# EAGLE design QuadADSR-v1 (EAGLE 9.1.3)

## Sheet 1 of 3: Main
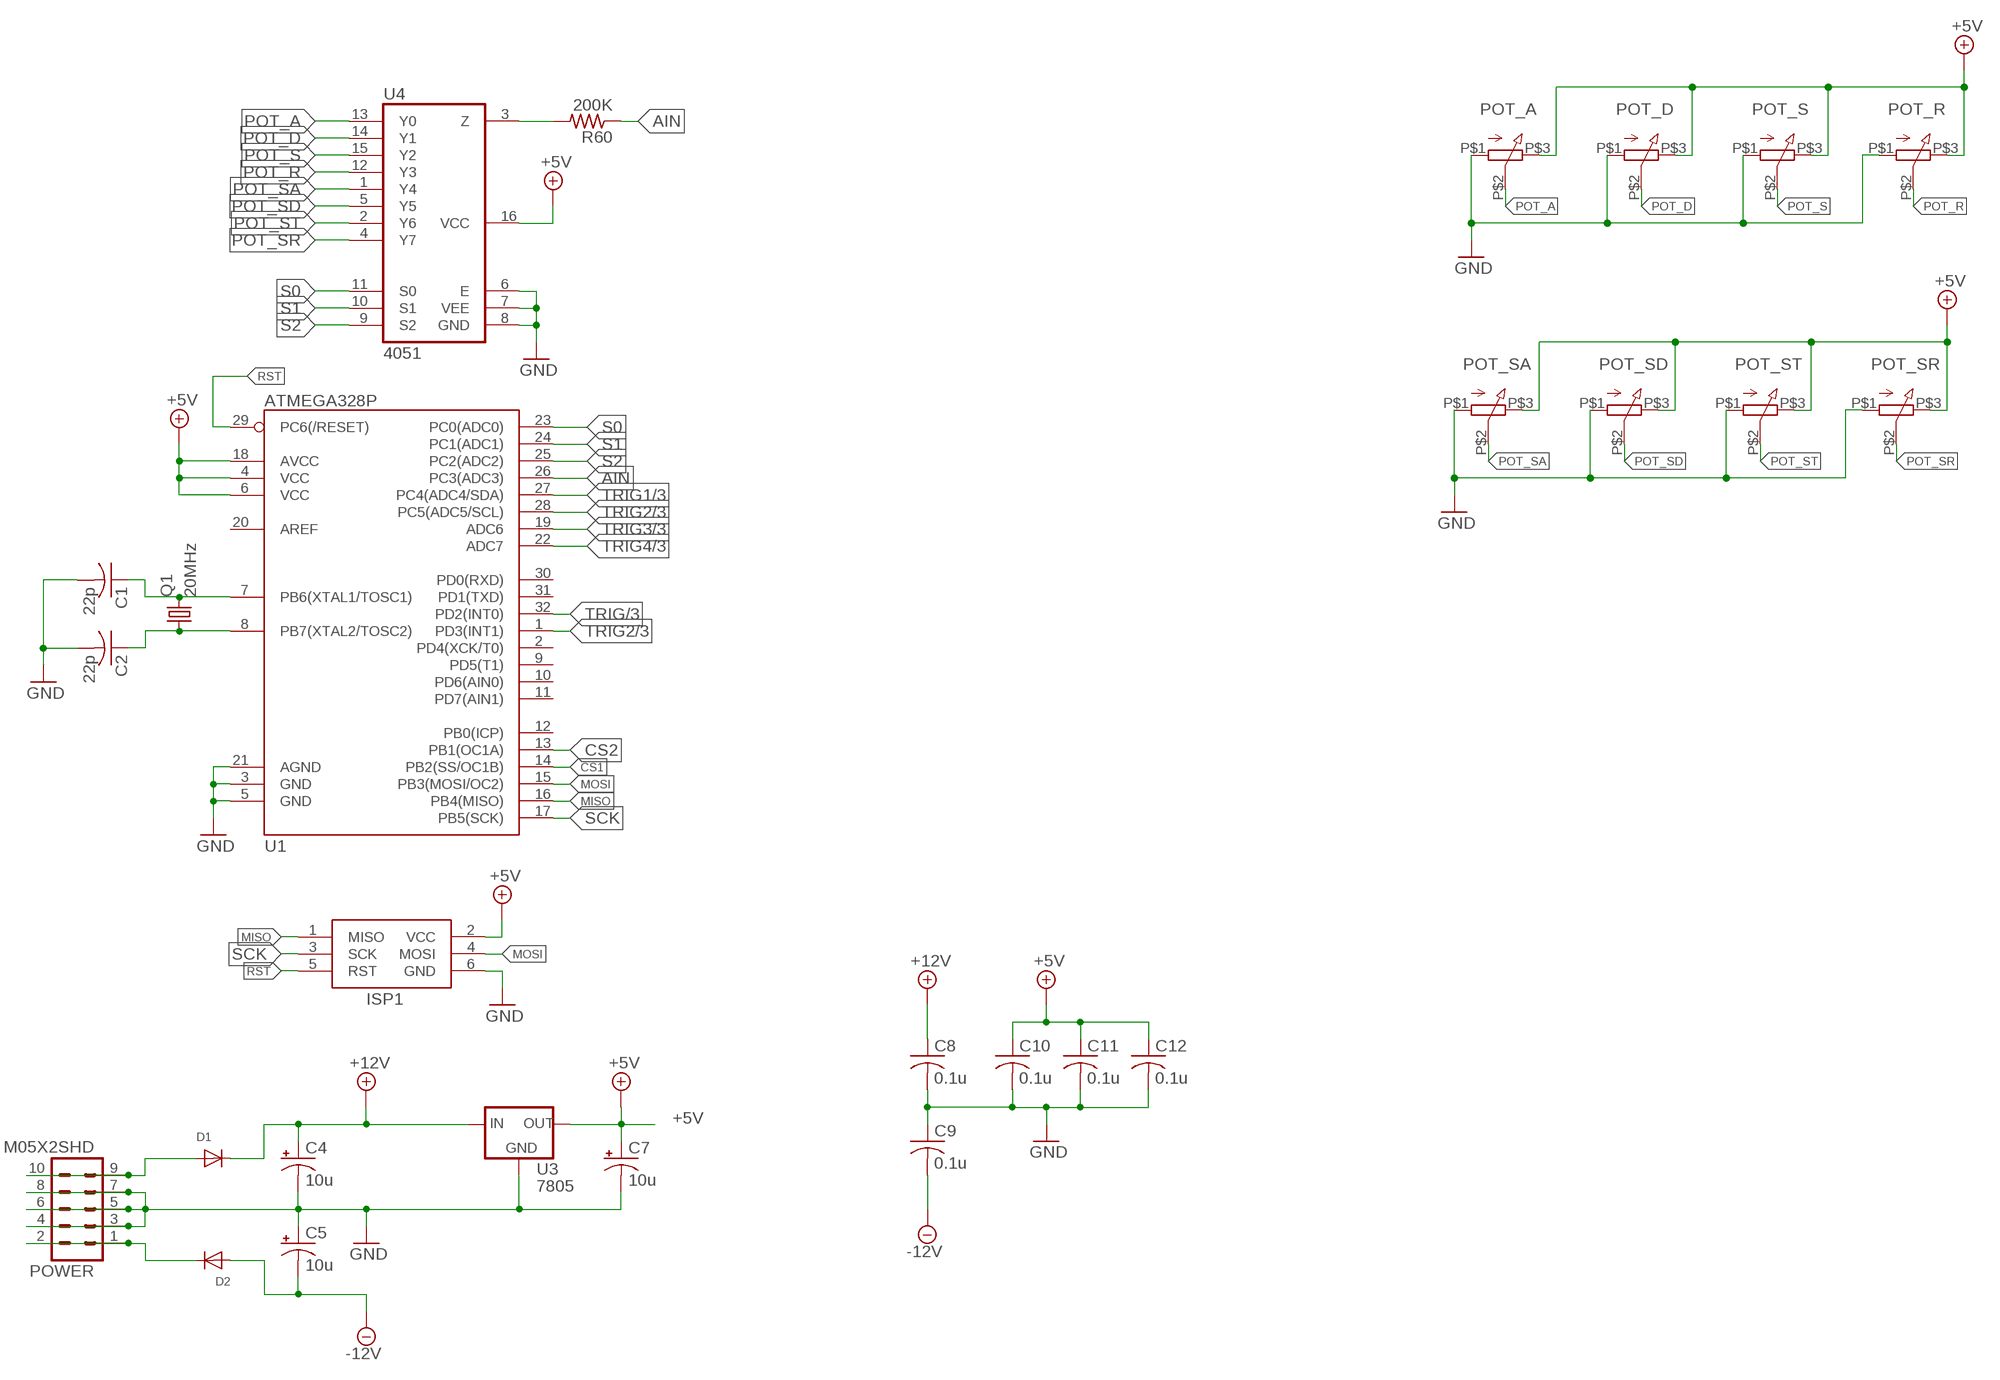
[diagram p0: schematic, sheet 1]

### Parts
C1  22p  C-USC0805K  [C0805K]
C2  22p  C-USC0805K  [C0805K]
C4  10u  CPOL-US153CLV-0505  [153CLV-0505]
C5  10u  CPOL-US153CLV-0505  [153CLV-0505]
C7  10u  CPOL-US153CLV-0505  [153CLV-0505]
C8  0.1u  C-USC0805K  [C0805K]
C9  0.1u  C-USC0805K  [C0805K]
C10  0.1u  C-USC0805K  [C0805K]
C11  0.1u  C-USC0805K  [C0805K]
C12  0.1u  C-USC0805K  [C0805K]
D1  DIODESMA  [SMADIODE]
D2  DIODESMA  [SMADIODE]
ISP1  AVRISP-6  [AVRISP]
POT_A  Q-POT  [Q-POT]
POT_D  Q-POT  [Q-POT]
POT_R  Q-POT  [Q-POT]
POT_S  Q-POT  [Q-POT]
POT_SA  Q-POT  [Q-POT]
POT_SD  Q-POT  [Q-POT]
POT_SR  Q-POT  [Q-POT]
POT_ST  Q-POT  [Q-POT]
POWER  M05X2SHD  [2X5-SHROUDED]
Q1  20MHz  CRYSTALHC49UP  [HC49UP]
R60  200K  R-US_R0805  [R0805]
U1  ATMEGA328P  ATMEGA328_SMT  [TQFP32-08]
U3  7805  V-REG  [V-REG]
U4  4051  MUX!  [N2222_ARRAY]

### Nets
+5V: C7.+ C10.1 C11.1 C12.1 ISP1.2(VCC) POT_A.P$3 POT_D.P$3 POT_R.P$3 POT_S.P$3 POT_SA.P$3 POT_SD.P$3 POT_SR.P$3 POT_ST.P$3 U1.4(VCC) U1.6(VCC) U1.18(AVCC) U3.3(OUT) U4.16(VCC) ; also sheet 2,3
+12V [Power]: C4.+ C8.1 D1.C U3.1(IN) ; also sheet 2
-12V [Power]: C5.- C9.2 D2.A ; also sheet 2
AIN: R60.1 U1.26(PC3(ADC3))
CS1: U1.14(PB2(SS/OC1B)) ; also sheet 2
CS2: U1.13(PB1(OC1A)) ; also sheet 2
GND [Power]: C1.2 C2.2 C4.- C5.+ C7.- C8.2 C9.1 C10.2 C11.2 C12.2 ISP1.6(GND) POT_A.P$1 POT_D.P$1 POT_R.P$1 POT_S.P$1 POT_SA.P$1 POT_SD.P$1 POT_SR.P$1 POT_ST.P$1 POWER.3 POWER.4 POWER.5 POWER.6 POWER.7 POWER.8 U1.3(GND) U1.5(GND) U1.21(AGND) U3.4(GND) U4.6(E) U4.7(VEE) U4.8(GND) ; also sheet 2,3
MISO: ISP1.1(MISO) U1.16(PB4(MISO))
MOSI: ISP1.4(MOSI) U1.15(PB3(MOSI/OC2)) ; also sheet 2
N$1: C1.1 Q1.2 U1.7(PB6(XTAL1/TOSC1))
N$2: C2.1 Q1.1 U1.8(PB7(XTAL2/TOSC2))
N$9: D1.A POWER.9 POWER.10
N$10: D2.C POWER.1 POWER.2
N$69: R60.2 U4.3(Z)
POT_A: POT_A.P$2 U4.13(Y0)
POT_D: POT_D.P$2 U4.14(Y1)
POT_R: POT_R.P$2 U4.12(Y3)
POT_S: POT_S.P$2 U4.15(Y2)
POT_SA: POT_SA.P$2 U4.1(Y4)
POT_SD: POT_SD.P$2 U4.5(Y5)
POT_SR: POT_SR.P$2 U4.4(Y7)
POT_ST: POT_ST.P$2 U4.2(Y6)
RST: ISP1.5(RST) U1.29(PC6(/RESET))
S0: U1.23(PC0(ADC0)) U4.11(S0)
S1: U1.24(PC1(ADC1)) U4.10(S1)
S2: U1.25(PC2(ADC2)) U4.9(S2)
SCK: ISP1.3(SCK) U1.17(PB5(SCK)) ; also sheet 2
TRIG: U1.32(PD2(INT0)) ; also sheet 3
TRIG1: U1.27(PC4(ADC4/SDA)) ; also sheet 3
TRIG2: U1.1(PD3(INT1)) U1.28(PC5(ADC5/SCL)) ; also sheet 3
TRIG3: U1.19(ADC6) ; also sheet 3
TRIG4: U1.22(ADC7) ; also sheet 3
Unconnected: U1.2(PD4(XCK/T0)) U1.9(PD5(T1)) U1.10(PD6(AIN0)) U1.11(PD7(AIN1)) U1.12(PB0(ICP)) U1.20(AREF) U1.30(PD0(RXD)) U1.31(PD1(TXD))

## Sheet 2 of 3: Analog out
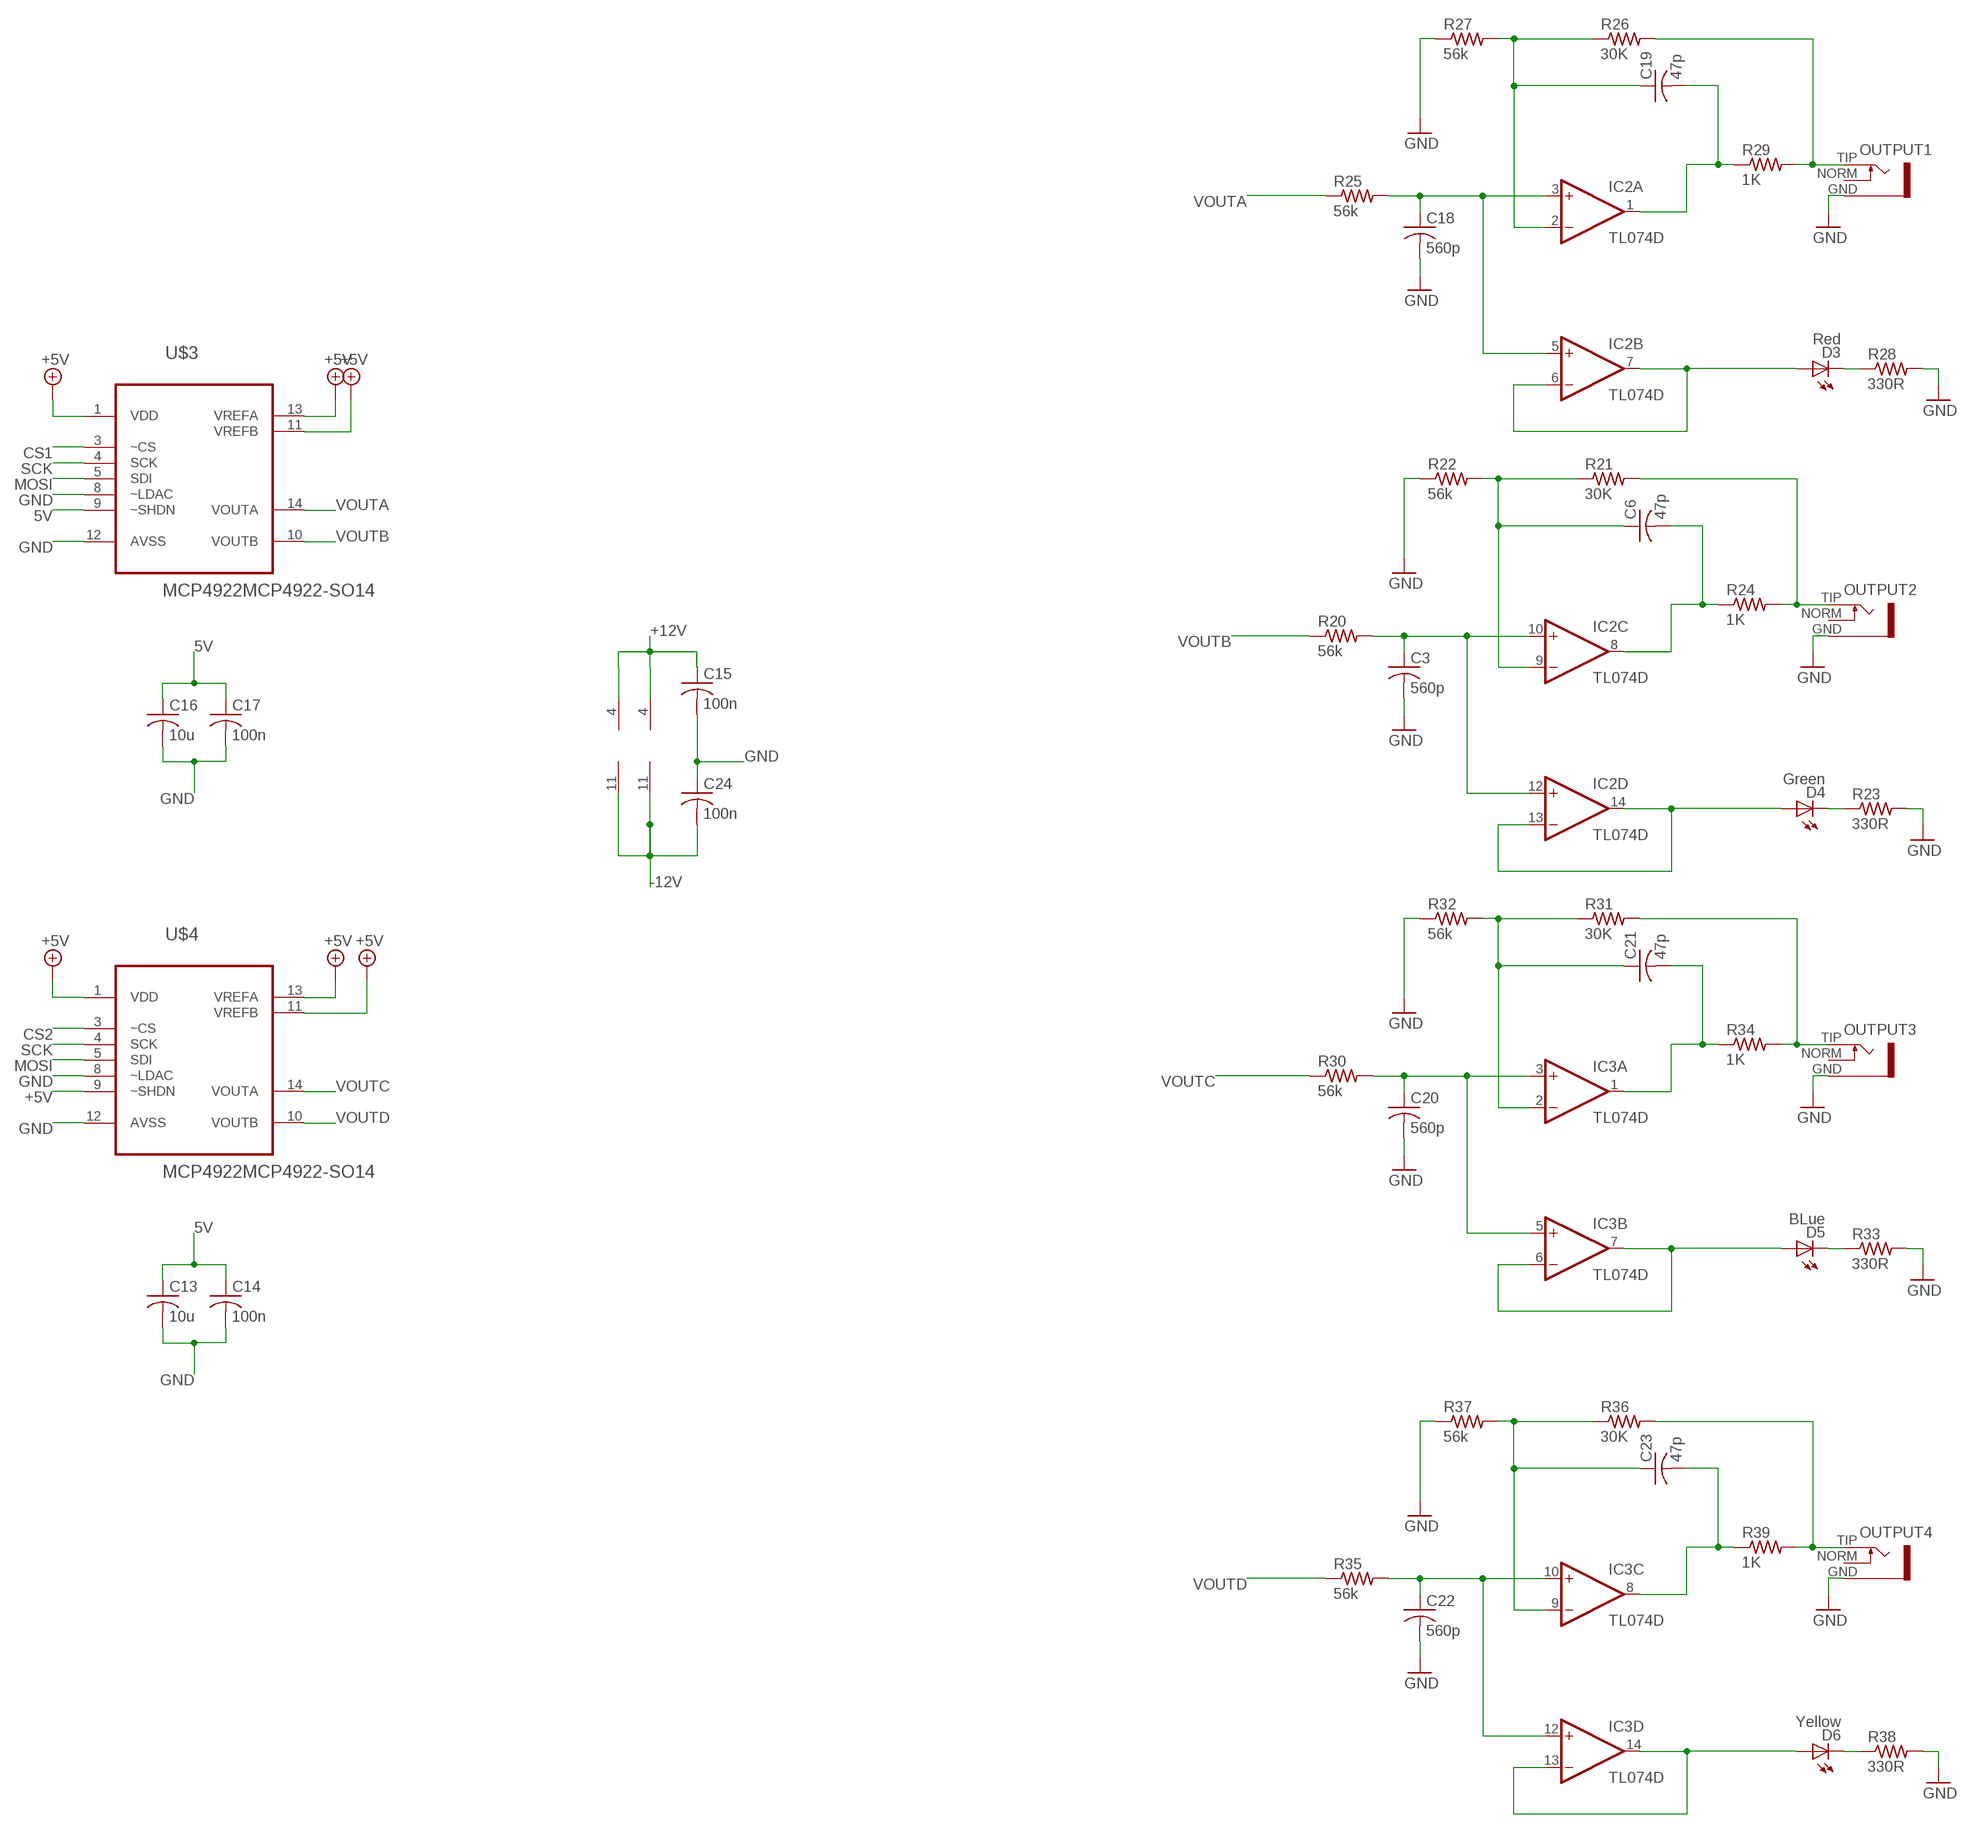
[diagram p1: schematic, sheet 2]

### Parts
C3  560p  C-USC0805K  [C0805K]
C6  47p  C-USC0805K  [C0805K]
C13  10u  C-USC0805K  [C0805K]
C14  100n  C-USC0805K  [C0805K]
C15  100n  C-USC0805K  [C0805K]
C16  10u  C-USC0805K  [C0805K]
C17  100n  C-USC0805K  [C0805K]
C18  560p  C-USC0805K  [C0805K]
C19  47p  C-USC0805K  [C0805K]
C20  560p  C-USC0805K  [C0805K]
C21  47p  C-USC0805K  [C0805K]
C22  560p  C-USC0805K  [C0805K]
C23  47p  C-USC0805K  [C0805K]
C24  100n  C-USC0805K  [C0805K]
D3  Red  LED5MM  [LED5MM]
D4  Green  LED5MM  [LED5MM]
D5  BLue  LED5MM  [LED5MM]
D6  Yellow  LED5MM  [LED5MM]
IC2  TL074D  [SO14]
IC3  TL074D  [SO14]
OUTPUT1  S_JACK  [S_JACK]
OUTPUT2  S_JACK  [S_JACK]
OUTPUT3  S_JACK  [S_JACK]
OUTPUT4  S_JACK  [S_JACK]
R20  56k  R-US_R0805  [R0805]
R21  30K  R-US_R0805  [R0805]
R22  56k  R-US_R0805  [R0805]
R23  330R  R-US_R0805  [R0805]
R24  1K  R-US_R0805  [R0805]
R25  56k  R-US_R0805  [R0805]
R26  30K  R-US_R0805  [R0805]
R27  56k  R-US_R0805  [R0805]
R28  330R  R-US_R0805  [R0805]
R29  1K  R-US_R0805  [R0805]
R30  56k  R-US_R0805  [R0805]
R31  30K  R-US_R0805  [R0805]
R32  56k  R-US_R0805  [R0805]
R33  330R  R-US_R0805  [R0805]
R34  1K  R-US_R0805  [R0805]
R35  56k  R-US_R0805  [R0805]
R36  30K  R-US_R0805  [R0805]
R37  56k  R-US_R0805  [R0805]
R38  330R  R-US_R0805  [R0805]
R39  1K  R-US_R0805  [R0805]
U$3  MCP4922MCP4922-SO14  [SO14]
U$4  MCP4922MCP4922-SO14  [SO14]

### Nets
5V [Power]: C13.1 C14.1 C16.1 C17.1 U$3.9(~SHDN)
+5V: U$3.1(VDD) U$3.11(VREFB) U$3.13(VREFA) U$4.1(VDD) U$4.9(~SHDN) U$4.11(VREFB) U$4.13(VREFA) ; also sheet 1,3
+12V [Power]: C15.1 IC2.4(P:V+) IC3.4(P:V+) ; also sheet 1
-12V [Power]: C24.2 IC2.11(P:V-) IC3.11(P:V-) ; also sheet 1
CS1: U$3.3(~CS) ; also sheet 1
CS2: U$4.3(~CS) ; also sheet 1
GND [Power]: C3.2 C13.2 C14.2 C15.2 C16.2 C17.2 C18.2 C20.2 C22.2 C24.1 OUTPUT1.GND OUTPUT2.GND OUTPUT3.GND OUTPUT4.GND R22.1 R23.2 R27.1 R28.2 R32.1 R33.2 R37.1 R38.2 U$3.8(~LDAC) U$3.12(AVSS) U$4.8(~LDAC) U$4.12(AVSS) ; also sheet 1,3
MOSI: U$3.5(SDI) U$4.5(SDI) ; also sheet 1
N$16: C3.1 IC2.10(C:+IN) IC2.12(D:+IN) R20.2
N$17: C6.1 IC2.9(C:-IN) R21.1 R22.2
N$23: OUTPUT2.TIP R21.2 R24.2
N$24: D4.A IC2.13(D:-IN) IC2.14(D:OUT)
N$26: D4.K(C) R23.1
N$27: C6.2 IC2.8(C:OUT) R24.1
N$28: C18.1 IC2.3(A:+IN) IC2.5(B:+IN) R25.2
N$29: C19.1 IC2.2(A:-IN) R26.1 R27.2
N$30: OUTPUT1.TIP R26.2 R29.2
N$32: D3.A IC2.6(B:-IN) IC2.7(B:OUT)
N$33: D3.K(C) R28.1
N$34: C19.2 IC2.1(A:OUT) R29.1
N$38: C20.1 IC3.3(A:+IN) IC3.5(B:+IN) R30.2
N$39: C21.1 IC3.2(A:-IN) R31.1 R32.2
N$40: OUTPUT3.TIP R31.2 R34.2
N$41: D5.A IC3.6(B:-IN) IC3.7(B:OUT)
N$42: D5.K(C) R33.1
N$43: C21.2 IC3.1(A:OUT) R34.1
N$45: C22.1 IC3.10(C:+IN) IC3.12(D:+IN) R35.2
N$46: C23.1 IC3.9(C:-IN) R36.1 R37.2
N$47: OUTPUT4.TIP R36.2 R39.2
N$48: D6.A IC3.13(D:-IN) IC3.14(D:OUT)
N$49: D6.K(C) R38.1
N$50: C23.2 IC3.8(C:OUT) R39.1
SCK: U$3.4(SCK) U$4.4(SCK) ; also sheet 1
VOUTA: R25.1 U$3.14(VOUTA)
VOUTB: R20.1 U$3.10(VOUTB)
VOUTC: R30.1 U$4.14(VOUTA)
VOUTD: R35.1 U$4.10(VOUTB)
Unconnected: OUTPUT1.NORM OUTPUT2.NORM OUTPUT3.NORM OUTPUT4.NORM

## Sheet 3 of 3: Triggers
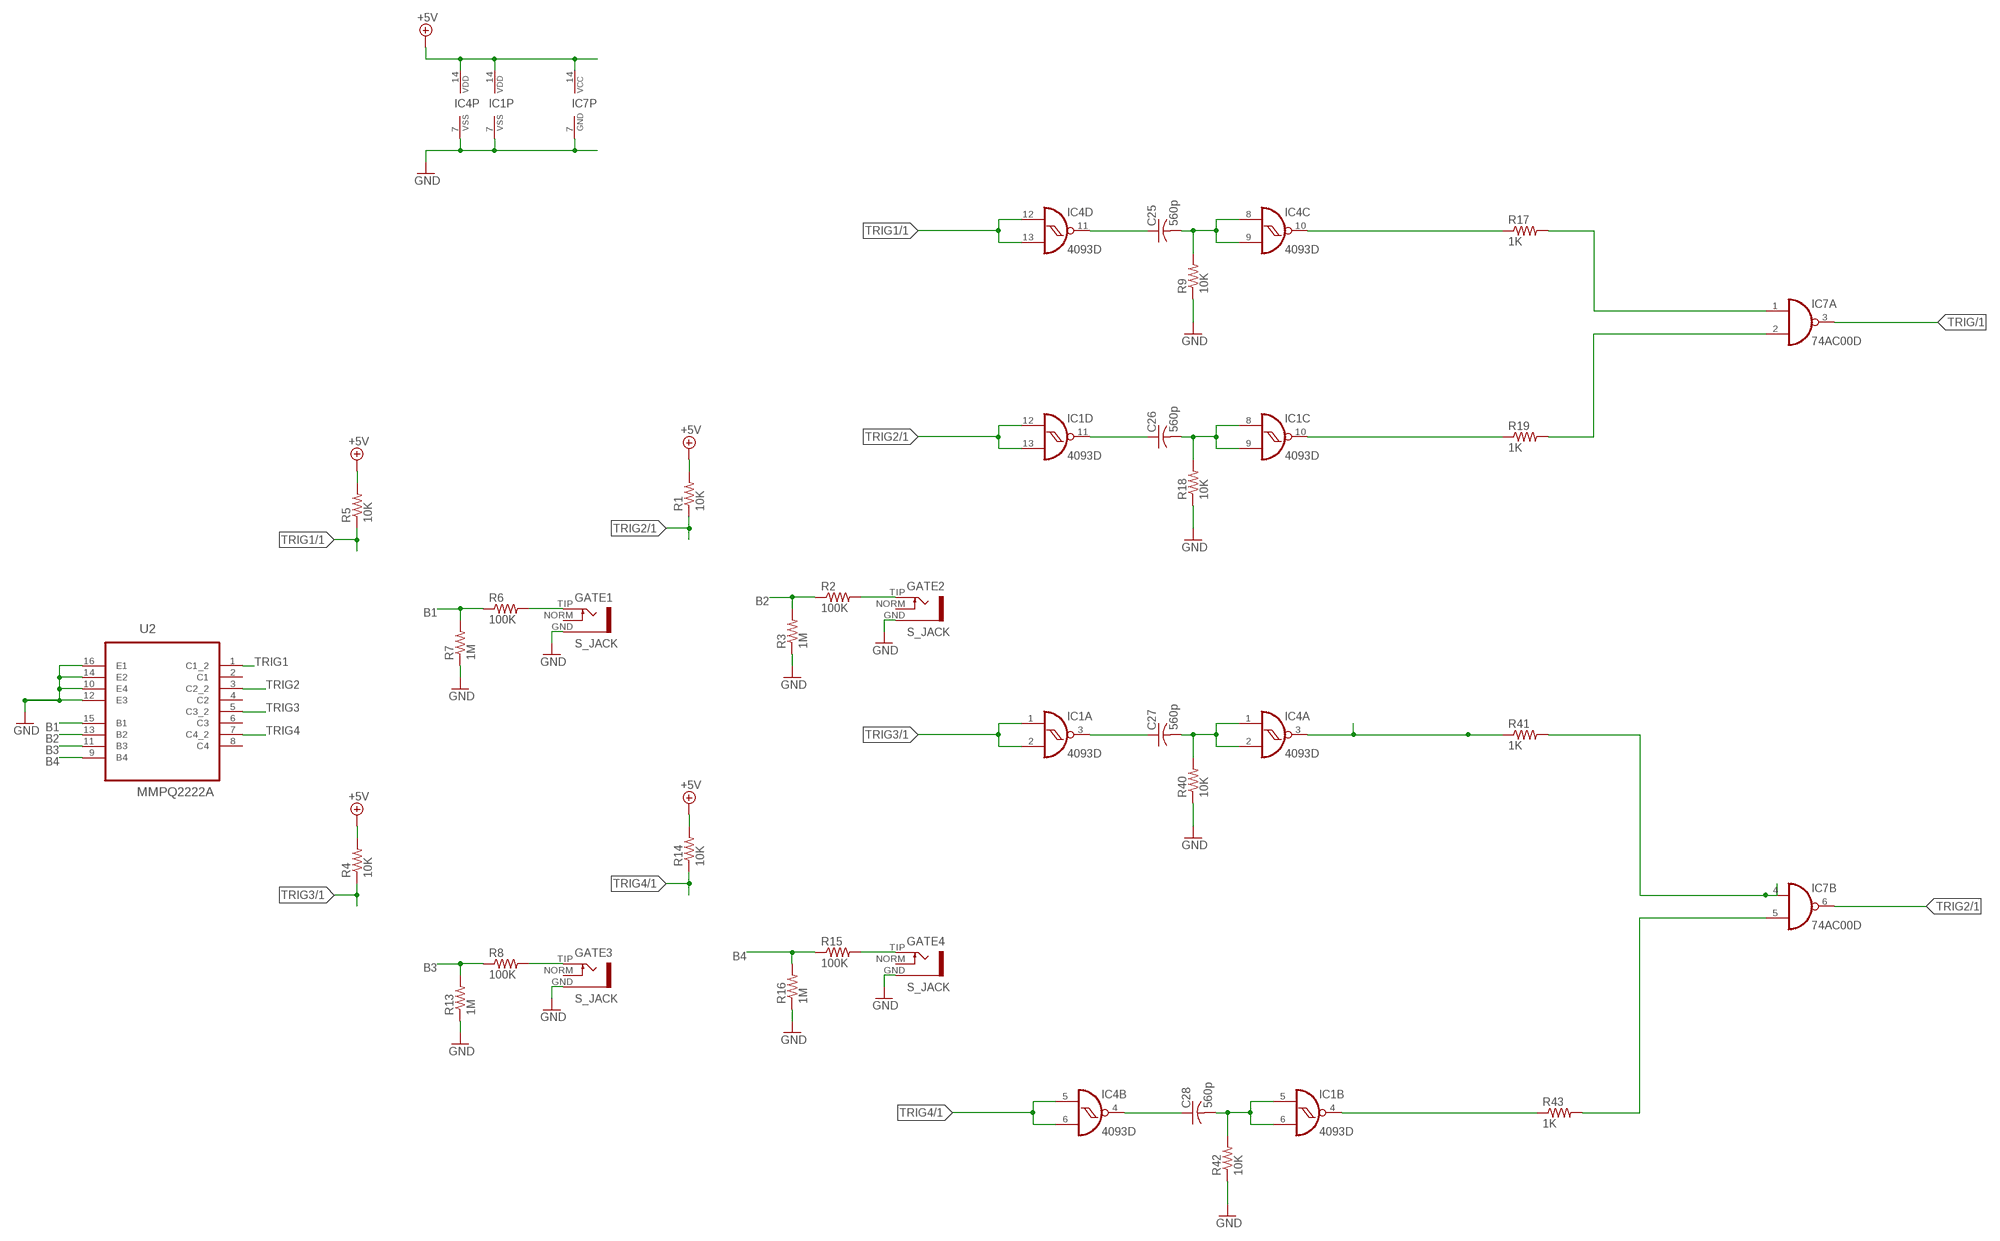
[diagram p2: schematic, sheet 3]

### Parts
C25  560p  C-USC0805K  [C0805K]
C26  560p  C-USC0805K  [C0805K]
C27  560p  C-USC0805K  [C0805K]
C28  560p  C-USC0805K  [C0805K]
GATE1  S_JACK  [S_JACK]
GATE2  S_JACK  [S_JACK]
GATE3  S_JACK  [S_JACK]
GATE4  S_JACK  [S_JACK]
IC1  4093D  [SO14]
IC4  4093D  [SO14]
IC7  74AC00D  [SO14]
R1  10K  R-US_R0805  [R0805]
R2  100K  R-US_R0805  [R0805]
R3  1M  R-US_R0805  [R0805]
R4  10K  R-US_R0805  [R0805]
R5  10K  R-US_R0805  [R0805]
R6  100K  R-US_R0805  [R0805]
R7  1M  R-US_R0805  [R0805]
R8  100K  R-US_R0805  [R0805]
R9  10K  R-US_R0805  [R0805]
R13  1M  R-US_R0805  [R0805]
R14  10K  R-US_R0805  [R0805]
R15  100K  R-US_R0805  [R0805]
R16  1M  R-US_R0805  [R0805]
R17  1K  R-US_R0805  [R0805]
R18  10K  R-US_R0805  [R0805]
R19  1K  R-US_R0805  [R0805]
R40  10K  R-US_R0805  [R0805]
R41  1K  R-US_R0805  [R0805]
R42  10K  R-US_R0805  [R0805]
R43  1K  R-US_R0805  [R0805]
U2  MMPQ2222A  [SOIC127P600X175-16N]

### Nets
+5V: IC1.14(P:VDD) IC4.14(P:VDD) IC7.14(P:VCC) R1.2 R4.2 R5.2 R14.2 ; also sheet 1,2
B1: R6.1 R7.2 U2.15(B1)
B2: R2.1 R3.2 U2.13(B2)
B3: R8.1 R13.2 U2.11(B3)
B4: R15.1 R16.2 U2.9(B4)
GND [Power]: GATE1.GND GATE2.GND GATE3.GND GATE4.GND IC1.7(P:VSS) IC4.7(P:VSS) IC7.7(P:GND) R3.1 R7.1 R9.1 R13.1 R16.1 R18.1 R40.1 R42.1 U2.10(E4) U2.12(E3) U2.14(E2) U2.16(E1) ; also sheet 1,2
N$4: GATE2.TIP R2.2
N$6: GATE3.TIP R8.2
N$8: GATE4.TIP R15.2
N$11: C26.2 IC1.8(C:I0) IC1.9(C:I1) R18.2
N$14: IC1.10(C:O) R19.1
N$18: GATE1.TIP R6.2
N$19: C25.2 IC4.8(C:I0) IC4.9(C:I1) R9.2
N$20: IC4.10(C:O) R17.1
N$22: C25.1 IC4.11(D:O)
N$31: C26.1 IC1.11(D:O)
N$35: C27.2 IC4.1(A:I0) IC4.2(A:I1) R40.2
N$36: IC4.3(A:O) R41.1
N$44: C27.1 IC1.3(A:O)
N$51: C28.2 IC1.5(B:I0) IC1.6(B:I1) R42.2
N$52: IC1.4(B:O) R43.1
N$54: C28.1 IC4.4(B:O)
PULSE1: IC7.1(A:I0) R17.2
PULSE2: IC7.2(A:I1) R19.2
PULSE3: IC7.4(B:I0) R41.2
PULSE4: IC7.5(B:I1) R43.2
TRIG: IC7.3(A:O) ; also sheet 1
TRIG1: IC4.12(D:I0) IC4.13(D:I1) R5.1 U2.1(C1_2) ; also sheet 1
TRIG2: IC1.12(D:I0) IC1.13(D:I1) IC7.6(B:O) R1.1 U2.3(C2_2) ; also sheet 1
TRIG3: IC1.1(A:I0) IC1.2(A:I1) R4.1 U2.5(C3_2) ; also sheet 1
TRIG4: IC4.5(B:I0) IC4.6(B:I1) R14.1 U2.7(C4_2) ; also sheet 1
Unconnected: GATE1.NORM GATE2.NORM GATE3.NORM GATE4.NORM IC7.8(C:O) IC7.9(C:I0) IC7.10(C:I1) IC7.11(D:O) IC7.12(D:I0) IC7.13(D:I1) U2.2(C1) U2.4(C2) U2.6(C3) U2.8(C4)

## Library data of the parts
C1 C2 C8-C17 C24 = rcl:C-US: CAPACITOR, American symbol; SPICEPREFIX: C
C3 C6 C18-C23 C25-C28 = rcl:C-US: CAPACITOR, American symbol
C4 C5 C7 = rcl:CPOL-US: POLARIZED CAPACITOR, American symbol; SPICEPREFIX: C
D1 D2 = adafruit:DIODE: Diode SMADIODE - SMA Surface Mount Package 20V 1A Schottky Diode Digikey: 641-1014-6-ND DO-1N4148 - Through Hole Small Current Diode SOD-123 20V 1 A (.5mV Vf) Schottky Diode - Digikey: MBRX120TPMSCT-ND SOD-323 10V 570mA (.38mV Vf, 3ns) Schottky Diode - Digikey: ZLLS410CT-ND SOD-523 30V 30mA Schottky Diode (RB751S-40TE61) - Digikey: RB751S-40TE61CT-ND SOT23-R/W - SOT23 Package (R = Solder Paste/Reflow Ovens, W = Hand-Soldering) BAT54Film 40V 300mA - Digikey: 497-7162-1-ND
D3-D6 = led:LED: LED OSRAM: - CHIPLED LG R971, LG N971, LY N971, LG Q971, LY Q971, LO R971, LY R971 LH N974, LH R974 LS Q976, LO Q976, LY Q976 LO Q996 - Hyper CHIPLED LW Q18S LB Q993, LB Q99A, LB R99A - SideLED LS A670, LO A670, LY A670, LG A670, LP A670 LB A673, LV A673, LT A673, LW A673 LH A674 LY A675 LS A676, LA A676, LO A676, LY A676, LW A676 LS A679, LY A679, LG A679 - Hyper Micro SIDELED® LS Y876, LA Y876, LO Y876, LY Y876 LT Y87S - SmartLED LW L88C, LW L88S LB L89C, LB L89S, LG L890 LS L89K, LO L89K, LY L89K LS L896, LA L896, LO L896, LY L896 - TOPLED LS T670, LO T670, LY T670, LG T670, LP T670 LSG T670, LSP T670, LSY T670, LOP T670, LYG T670 LG T671, LOG T671, LSG T671 LB T673, LV T673, LT T673, LW T673 LH T674 LS T676, LA T676, LO T676, LY T676, LB T676, LH T676, LSB T676, LW T676 LB T67C, LV T67C, LT T67C, LS T67K, LO T67K, LY T67K, LW E67C LS E67B, LA E67B, LO E67B, LY E67B, LB E67C, LV E67C, LT E67C LW T67C LS T679, LY T679, LG T679 LS T770, LO T770, LY T770, LG T770, LP T770 LB T773, LV T773, LT T773, LW T773 LH T774 LS E675, LA E675, LY E675, LS T675 LS T776, LA T776, LO T776, LY T776, LB T776 LHGB T686 LT T68C, LB T68C - Hyper Mini TOPLED® LB M676 - Mini TOPLED Santana® LG M470 LS M47K, LO M47K, LY M47K Source: http://www.osram.convergy.de LUXEON: - LUMILED® LXK2-PW12-R00, LXK2-PW12-S00, LXK2-PW14-U00, LXK2-PW14-V00 LXK2-PM12-R00, LXK2-PM12-S00, LXK2-PM14-U00 LXK2-PE12-Q00, LXK2-PE12-R00, LXK2-PE12-S00, LXK2-PE14-T00, LXK2-PE14-U00 LXK2-PB12-K00, LXK2-PB12-L00, LXK2-PB12-M00, LXK2-PB14-N00, LXK2-PB14-P00, LXK2-PB14-Q00 LXK2-PR12-L00, LXK2-PR12-M00, LXK2-PR14-Q00, LXK2-PR14-R00 LXK2-PD12-Q00, LXK2-PD12-R00, LXK2-PD12-S00 LXK2-PH12-R00, LXK2-PH12-S00 LXK2-PL12-P00, LXK2-PL12-Q00, LXK2-PL12-R00 Source: www.luxeon.com KINGBRIGHT: KA-3528ASYC Source: www.kingbright.com
GATE1-GATE4 OUTPUT1-OUTPUT4 = INSTRUO:S_JACK
IC1 IC4 = 40xx:4093: Quad 2-input NAND schmitt trigger
IC2 IC3 = linear:TL074: OP AMP
IC7 = 74xx-eu:74*00: Quad 2-input NAND gate
ISP1 = adafruit:AVRISP: AVR ISP HEADER Standard 6 pin header for AVR programming
POT_A POT_D POT_R POT_S POT_SA POT_SD POT_SR POT_ST = INSTRUO:Q-POT
POWER = SparkFun-Connectors:M05X2: Header 5x2 Standard 10-pin dual row 0.1" header. Commonly used with AVR-ISP. Use with Spark Fun Electronics SKU: PRT-00778
Q1 = adafruit:CRYSTAL: CRYSTAL; OC_FARNELL: unknown; OC_NEWARK: unknown
R1-R8 R13-R16 = rcl:R-US_: RESISTOR, American symbol; SPICEPREFIX: R
R9 R17-R43 R60 = rcl:R-US_: RESISTOR, American symbol
U1 = SparkFun-DigitalIC:ATMEGA328_SMT: 32-Pin Atmega328 part Commonly used on Arduino compatible boards Available in QFP and QFN packages TQFP is IC-09069 QFN is non-stock; PROD_ID: IC-09069
U2 = Fairchild_By_element14_Batch_1:MMPQ2222A: NPN Multi-Chip General Purpose Amplifier; MPN: MMPQ2222A; OC_FARNELL: 2101390; OC_NEWARK: 10P1562; PACKAGE: SOIC-16; SUPPLIER: FAIRCHILD SEMICONDUCTOR
U3 = INSTRUO:V-REG
U4 = INSTRUO:MUX!
U$3 U$4 = GMSN-R2Project:MCP4922

## Net classes
1 Power: width 0.5 mm

## Board
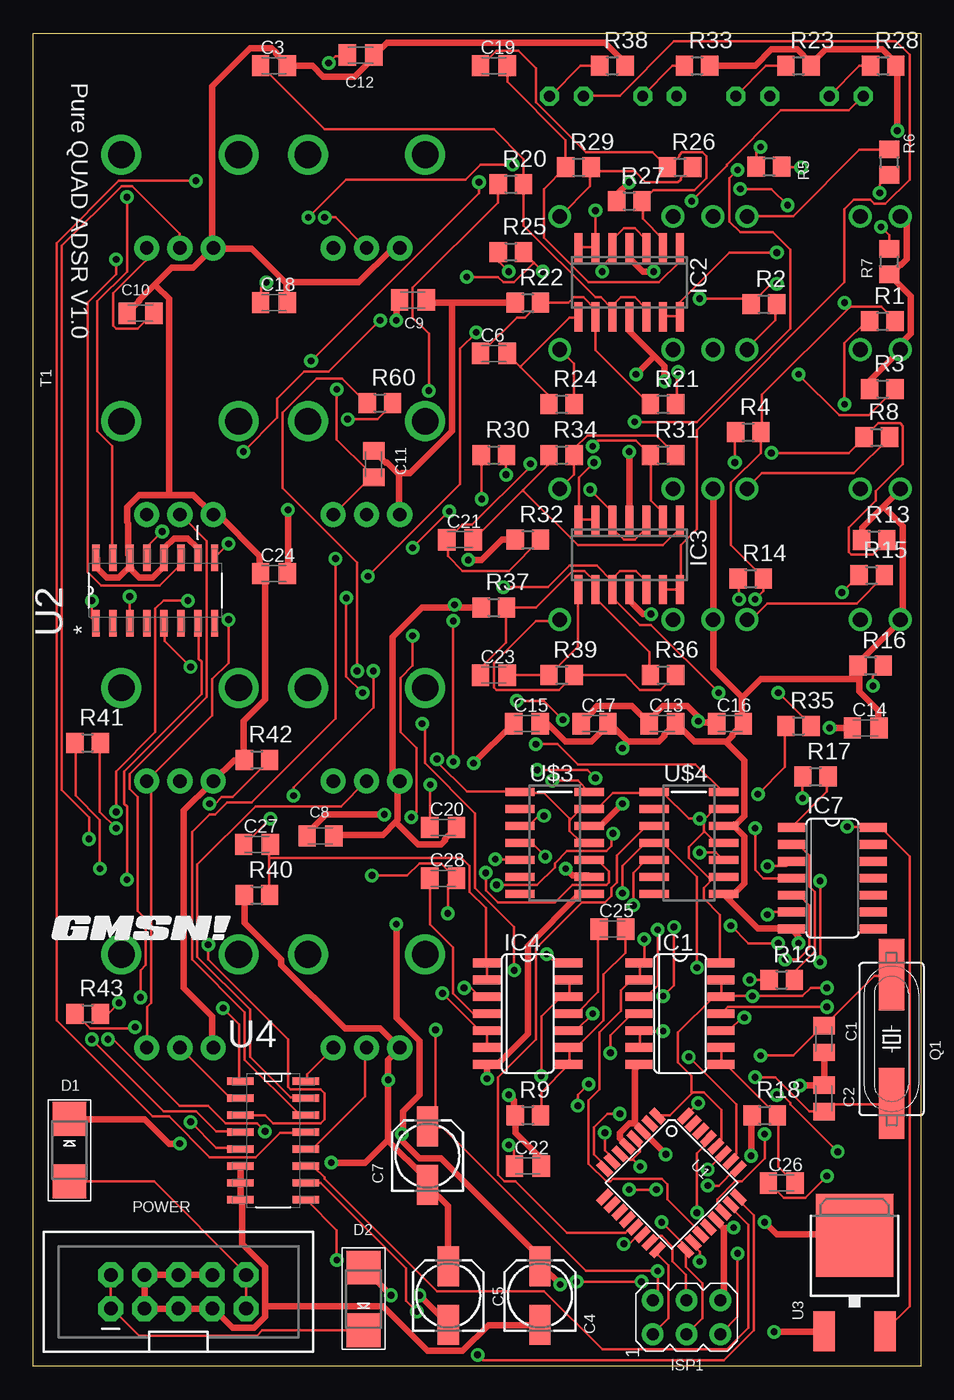
[diagram p3: board, top side]
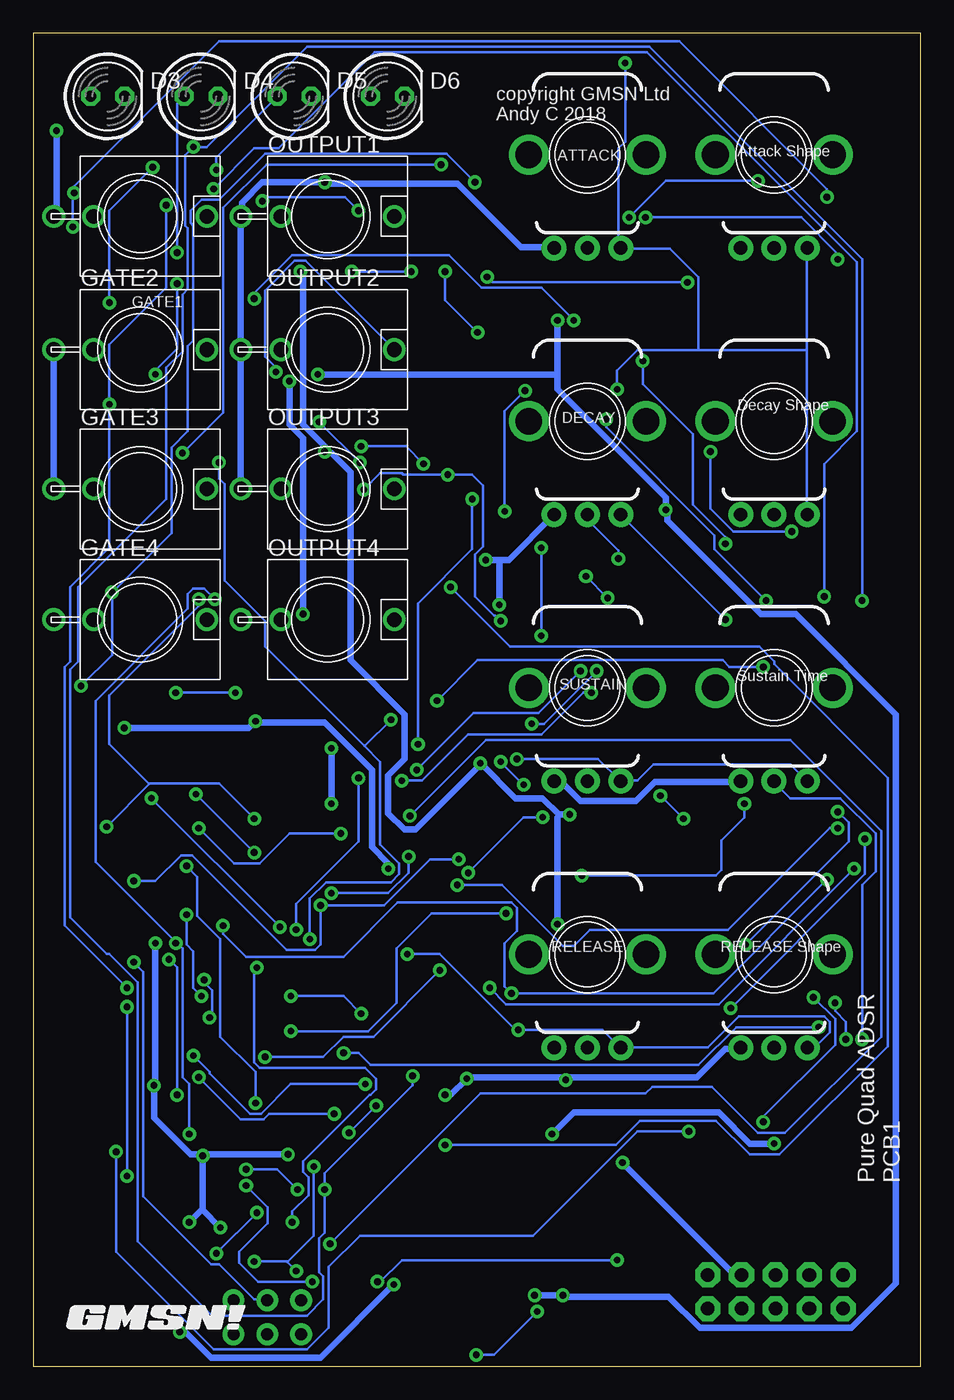
[diagram p4: board, bottom side, seen from below]

Size 66.58 x 100 mm. Coordinates in mm from the lower left corner, seen from the top.
Outline: 66.58,0 0,0 0,100 66.58,100 66.58,0
Copper layers (1*16): Top 0.035mm / dielectric 1.5mm / Bottom 0.035mm
Design rules "SparkFun": minimum track width 8mil, minimum drill 20mil, track to track 8mil, track to pad 8mil, pad to pad 8mil, via to via 8mil, smd to smd 8mil, copper to edge 10mil, drill to drill 8mil, minimum pad ring 12mil, minimum via ring 10mil, stop-mask expansion 4mil, vias tented up to drill 25mil, thermal gap 10mil

### Footprints (pad centres in the part's own frame; a part is rotated, then mirrored left to right if it is on the bottom)
C0805K = smd 1.3 x 1.6: 1 -1,0; 2 1,0
153CLV-0505 = smd 3 x 1.6: + 2.2,0; - -2.2,0
SMADIODE = smd 2.54 x 2.54: A 2.349,0; C -2.349,0
LED5MM = drill 0.813 octagon: A -1.27,0; K 1.27,0
S_JACK = drill 1.1: GND 0,-6.5; NORM 0,-3.5; TIP 0,5
SO14 = smd 0.66 x 2.032: 1 -3.81,-3.073; 2 -2.54,-3.073; 3 -1.27,-3.073; 4 0,-3.073; 5 1.27,-3.073; 6 2.54,-3.073; 7 3.81,-3.073; 8 3.81,3.073; 9 2.54,3.073; 10 1.27,3.073; 11 0,3.073; 12 -1.27,3.073; 13 -2.54,3.073; 14 -3.81,3.073
SO14' = smd 0.6 x 2.2: 1 -3.81,-2.6; 2 -2.54,-2.6; 3 -1.27,-2.6; 4 0,-2.6; 5 1.27,-2.6; 6 2.54,-2.6; 7 3.81,-2.6; 8 3.81,2.6; 9 2.54,2.6; 10 1.27,2.6; 11 0,2.6; 12 -1.27,2.6; 13 -2.54,2.6; 14 -3.81,2.6
AVRISP = drill 0.9 pad 1.626: 1 -1.27,2.54; 2 1.27,2.54; 3 -1.27,0; 4 1.27,0; 5 -1.27,-2.54; 6 1.27,-2.54
Q-POT = drill 1 pad 1.88: P$1 -2.5,-7; P$2 0,-7; P$3 2.5,-7 | drill 2 pad 2.68: P$4 -4.4,0; P$5 4.4,0
2X5-SHROUDED = drill 1.016 pad 1.88 octagon: 1 -1.27,5.08; 2 1.27,5.08; 3 -1.27,2.54; 4 1.27,2.54; 5 -1.27,0; 6 1.27,0; 7 -1.27,-2.54; 8 1.27,-2.54; 9 -1.27,-5.08; 10 1.27,-5.08
HC49UP = smd 5.334 x 1.93: 1 -4.826,0; 2 4.826,0
R0805 = smd 1.3 x 1.5: 1 -0.95,0; 2 0.95,0
TQFP32-08 = smd 1.27 x 0.559: 1 -4.293,2.8; 2 -4.293,2; 3 -4.293,1.2; 4 -4.293,0.4; 5 -4.293,-0.4; 6 -4.293,-1.2; 7 -4.293,-2; 8 -4.293,-2.8; 17 4.293,-2.8; 18 4.293,-2; 19 4.293,-1.2; 20 4.293,-0.4; 21 4.293,0.4; 22 4.293,1.2; 23 4.293,2; 24 4.293,2.8 | smd 0.559 x 1.27: 9 -2.8,-4.293; 10 -2,-4.293; 11 -1.2,-4.293; 12 -0.4,-4.293; 13 0.4,-4.293; 14 1.2,-4.293; 15 2,-4.293; 16 2.8,-4.293; 25 2.8,4.293; 26 2,4.293; 27 1.2,4.293; 28 0.4,4.293; 29 -0.4,4.293; 30 -1.2,4.293; 31 -2,4.293; 32 -2.8,4.293
SOIC127P600X175-16N = smd 1.981 x 0.559: 1 -2.464,4.445; 2 -2.464,3.175; 3 -2.464,1.905; 4 -2.464,0.635; 5 -2.464,-0.635; 6 -2.464,-1.905; 7 -2.464,-3.175; 8 -2.464,-4.445; 9 2.464,-4.445; 10 2.464,-3.175; 11 2.464,-1.905; 12 2.464,-0.635; 13 2.464,0.635; 14 2.464,1.905; 15 2.464,3.175; 16 2.464,4.445
V-REG = smd 1.6 x 3: 1 -2.28,-4.8; 3 2.28,-4.8 | smd 5.8 x 6.2: 4 0,2.38
N2222_ARRAY = smd 1.981 x 0.559: 1 -2.464,4.445; 2 -2.464,3.175; 3 -2.464,1.905; 4 -2.464,0.635; 5 -2.464,-0.635; 6 -2.464,-1.905; 7 -2.464,-3.175; 8 -2.464,-4.445; 9 2.464,-4.445; 10 2.464,-3.175; 11 2.464,-1.905; 12 2.464,-0.635; 13 2.464,0.635; 14 2.464,1.905; 15 2.464,3.175; 16 2.464,4.445

### Placement (x,y rotation side)
C1  59.33,24.54 270 top
C2  59.33,20.1 90 top
C3  18.05,97.57 0 top
C4  38.02,5.3 90 top
C5  31.15,5.3 90 top
C6  34.56,75.98 0 top
C7  29.57,15.8 90 top
C8  21.54,39.78 0 top
C9  28.48,80 180 top
C10  8.05,79 180 top
C11  25.54,67.68 90 top
C12  24.56,98.36 0 top
C13  47.2,48.21 0 top
C14  62.46,47.88 0 top
C15  37.04,48.21 0 top
C16  52.28,48.21 0 top
C17  42.12,48.21 0 top
C18  18.05,79.79 0 top
C19  34.56,97.57 0 top
C20  30.75,40.42 0 top
C21  32.02,62.01 0 top
C22  37.1,15.02 0 top
C23  34.56,51.85 0 top
C24  18.05,59.47 0 top
C25  43.45,32.8 0 top
C26  56.15,13.75 0 top
C27  16.78,39.15 0 top
C28  30.75,36.61 0 top
D1  2.71,16.21 270 top
D2  24.78,5.05 90 top
D3  61,95.27 0 bottom
D4  54,95.27 0 bottom
D5  47,95.27 0 bottom
D6  40,95.27 0 bottom
GATE1  58.55,86.27 270 bottom
GATE2  58.55,76.27 270 bottom
GATE3  58.55,65.82 270 bottom
GATE4  58.55,56.01 270 bottom
IC1  48.53,26.45 270 top
IC2  TL074D  [SO14']  44.72,81.31 180 top
IC3  TL074D  [SO14']  44.72,60.87 180 top
IC4  37.1,26.45 270 top
IC7  59.96,36.61 270 top
ISP1  49.02,3.67 90 top
OUTPUT1  44.5,86.27 270 bottom
OUTPUT2  44.5,76.27 270 bottom
OUTPUT3  44.5,65.82 270 bottom
OUTPUT4  44.5,56.01 270 bottom
POT_A  25,90.89 0 bottom
POT_D  25,70.89 0 bottom
POT_R  25,30.89 0 bottom
POT_S  25,50.89 0 bottom
POT_SA  11,90.89 0 bottom
POT_SD  11,70.89 0 bottom
POT_SR  11,50.89 0 bottom
POT_ST  11,30.89 0 bottom
POWER  10.89,5.58 90 top
Q1  64.41,24.54 90 top
R1  63.71,78.4 0 top
R2  54.82,79.67 0 top
R3  63.71,73.32 0 top
R4  53.64,70.07 0 top
R5  55.2,89.98 0 top
R6  64.25,90.33 90 top
R7  64.25,82.87 90 top
R8  63.29,69.69 0 top
R9  37.1,18.83 0 top
R13  63.1,61.99 0 top
R14  53.83,59.1 0 top
R15  62.91,59.34 0 top
R16  62.83,52.56 0 top
R17  58.69,44.23 0 top
R18  54.88,18.83 0 top
R19  56.15,28.99 0 top
R20  35.83,88.68 0 top
R21  47.26,72.17 0 top
R22  37.1,79.79 0 top
R23  57.42,97.57 0 top
R24  39.64,72.17 0 top
R25  35.83,83.6 0 top
R26  48.53,89.95 0 top
R27  44.72,87.41 0 top
R28  63.77,97.57 0 top
R29  40.91,89.95 0 top
R30  34.56,68.36 0 top
R31  47.26,68.36 0 top
R32  37.1,62.01 0 top
R33  49.8,97.57 0 top
R34  39.64,68.36 0 top
R35  57.42,48.04 0 top
R36  47.26,51.85 0 top
R37  34.56,56.93 0 top
R38  43.45,97.57 0 top
R39  39.64,51.85 0 top
R40  16.78,35.34 0 top
R41  4.08,46.77 0 top
R42  16.78,45.5 0 top
R43  4.08,26.45 0 top
R60  26,72.27 0 top
U1  47.9,13.75 315 top
U2  9.16,58.2 90 top
U3  61.62,7.43 0 top
U4  18,16.93 0 top
U$1  [GMSN!_LOGO]  57.1,3.59 0 bottom
U$2  [GMSN!_LOGO]  8.37,32.8 0 top
U$3  MCP4922MCP4922-SO14  [SO14']  39.12,39.26 270 top
U$4  MCP4922MCP4922-SO14  [SO14']  49.19,39.26 270 top

### Tracks (layer width: path | path; a pad name or v marks a point on that pad's centre or on a via)
5V  (via drill 0.51)
  Top 0.5: C17.1 41.16,48.29 41.98,49.11 41.98,49.21 42.28,49.51 44.92,49.51 46.14,48.29 C13.1 46.24,48.5 47.26,49.51 49.09,49.51 50.05,48.55 | 50.05,48.55 50.31,48.29 51.22,48.29 C16.1 | v59.76,47.89 61.38,47.89 C14.1 | v49.9,48.4 50.05,48.55 | v39.95,37.32 40.45,36.81 41.67,36.81 U$3.9
  Bottom 0.5: v59.76,47.89 50.41,47.89 v49.9,48.4 49.7,48.29 44.72,48.29 41.16,44.74 41.16,38.95 39.95,37.73 v39.95,37.32
+5V  (via drill 0.51)
  Top 0.203: v22.16,97.77 22.67,98.28 23.49,98.28 C12.1 | POT_D.P$3 22.57,63.94 25.21,66.58 25.52,66.58 C11.1 25.11,66.58 25.11,67.19 22.77,69.53 v22.77,73.29 | C10.1 8.96,78.98 7.84,77.86 6.21,77.86 6.01,78.06 6.01,80.5 8.45,82.94 8.45,83.85 POT_SA.P$3 | 61.23,79.43 54.68,72.88 54.68,70.14 R4.2 54.58,70.04 54.58,68.51 52.34,66.28 52.34,61.6 54.78,59.16 R14.2 54.78,59.06 54.78,58.15 v54.17,57.54 | 61.23,79.43 61.28,79.48 63.62,79.48 64.63,78.47 R1.2 | v57.62,89.95 56.2,89.95 R5.2 | v60.87,79.79 61.18,79.48 61.23,79.43 | U3.3 63.92,2.68 65.75,4.5 65.75,38.24 63.62,40.37 63.11,40.37 IC7.14 63.01,40.47 v61.08,40.47 | 44.97,15.53 45.53,16.09 45.53,16.7 45.23,17 U1.4 | 44.97,15.53 44.92,15.48 44.72,15.48 44.31,15.88 44.11,15.88 U1.6 | v50,7.86 50,8.57 49.6,8.97 49.6,9.28 U1.18 | ISP1.2 46.55,5.01 46.85,5.32 v46.85,7.15 41.47,7.15 30.7,17.92 30.19,17.92 | v45.53,14.97 45.02,15.48 44.97,15.53 | 30.19,17.92 29.58,17.92 C7.+ 30.19,17.92 | U4.16 20.54,21.47 20.54,21.88 22.47,23.81 POT_R.P$3 | v38.52,30.92 39.13,30.31 40.15,30.31 IC4.14 | IC1.14 51.53,30.31 51.53,33.87 50.31,35.09 50.31,35.9 51.12,36.71 51.73,36.71 U$4.9 50.82,36.51 49.19,38.13 49.19,38.95 50.31,40.06 50.36,40.11 | 50.36,40.11 50.31,40.17 50.31,40.98 50.36,41.03 | 50.36,40.11 51.12,39.35 51.73,39.35 U$4.11 | 50.36,41.03 51.12,41.79 51.73,41.79 U$4.13 | 40.3,41.03 41.06,41.79 41.67,41.79 U$3.13 41.77,41.89 42.38,41.89 43.5,43.01 46.55,43.01 U$4.1 46.65,43.01 47.26,43.01 49.19,41.08 v50,41.08 50.31,41.08 50.36,41.03 | 40.3,41.03 40.25,40.98 40.25,40.17 41.06,39.35 41.67,39.35 U$3.11 | 40.3,41.03 40.25,41.08 38.32,43.01 36.59,43.01 U$3.1 36.49,43.11 32.53,43.11 30.29,45.35 v30.29,45.55
  Top 0.203: POT_ST.P$3 8.55,23.91 8.55,26.96 8.86,27.26 8.86,43.52 8.55,43.82 POT_SR.P$3 8.55,43.92 13.43,48.8 13.43,51.55 14.65,52.76 v14.65,56.02 | v30.19,25.23 30.19,17.92
  Bottom 0.203: v22.16,97.77 22.16,91.88 22.67,91.37 22.67,84.06 22.57,83.96 POT_A.P$3 22.47,83.85 18.81,83.85 16.68,81.72 16.68,76.23 | 8.55,76.23 8.55,83.85 POT_SA.P$3 | 8.55,76.23 8.55,63.94 POT_SD.P$3 | v22.77,73.29 22.77,74.71 21.25,76.23 16.68,76.23 | 8.55,76.23 16.68,76.23 | v57.62,89.95 60.87,86.7 v60.87,79.79 | v50,7.86 47.56,7.86 47.51,7.81 | v46.85,7.15 47.51,7.81 | v45.53,14.97 45.53,9.79 47.46,7.86 47.51,7.81 | v38.52,30.92 36.08,30.92 30.39,25.23 v30.19,25.23 23.89,25.23 22.57,23.91 POT_R.P$3 22.47,23.91 15.97,23.91 13.63,26.25 7.23,26.25 6.82,25.84 6.82,25.03 7.94,23.91 8.45,23.91 POT_ST.P$3 | POT_SR.P$3 8.55,43.92 9.77,45.14 20.03,45.14 21.25,43.92 22.47,43.92 POT_S.P$3 22.57,43.92 24.2,45.55 v30.29,45.55 | 57.88,43.67 57.83,43.72 52.65,43.72 v50,41.08 | 57.88,43.67 v61.08,40.47 | v54.17,57.54 54.17,57.03 60.87,50.33 60.87,46.67 57.93,43.72 57.88,43.67 | v14.65,56.02 22.47,63.84 POT_D.P$3
+12V  (via drill 0.51)
  Top 0.5: v44.72,68.61 44.72,63.53 IC3.4 | v46.55,82.13 45.74,82.13 44.72,83.14 44.72,83.85 IC2.4 | v26.33,41.39 21.96,41.39 20.64,40.06 20.64,39.86 C8.1 | v33.04,45.25 35.98,48.19 C15.1 | v10.99,16.7 10.18,16.7 8.35,18.53 2.76,18.53 D1.C | v55.59,2.57 59.25,2.57 U3.1 | v39.54,6.13 38.22,7.45 C4.+ 38.01,7.55 38.01,8.16 30.6,15.58 28.97,15.58 27.65,16.9 v27.65,17.41 27.75,17.61 27.75,19.14 28.97,20.35 28.97,24.42 27.25,26.14 v27.25,33.16
  Bottom 0.5: v46.55,82.13 46.35,81.92 46.35,70.65 44.72,69.02 v44.72,68.61 44.52,68.51 44.21,68.51 42.79,67.09 42.79,52.97 38.73,48.9 38.73,45.55 39.95,44.33 39.95,41.49 38.73,40.27 37.91,40.27 33.14,45.04 v33.04,45.25 30.39,42.6 28.36,42.6 27.14,41.39 | 27.14,41.39 v26.33,41.39 | v10.99,16.7 12.82,16.7 15.15,19.03 26.03,19.03 v27.65,17.41 | v55.59,2.57 55.19,2.57 53.25,0.64 45.02,0.64 v39.54,6.13 | v27.25,33.16 27.25,41.18 27.14,41.39
-12V  (via drill 0.51)
  Top 0.5: v46.35,56.42 45.74,56.42 44.72,57.44 44.72,58.25 IC3.11 | v47.36,73.9 47.36,75.02 46.6,75.78 | 46.6,75.78 44.72,77.66 44.72,78.67 IC2.11 | v26.84,5.32 24.81,7.35 D2.A | v28.97,5.32 31.11,3.18 C5.- | v19.12,64.24 19.12,59.47 C24.2 | v27.25,78.47 27.25,79.79 27.45,79.99 C9.2 | v45.23,74.41 46.45,75.62 46.6,75.78
  Bottom 0.5: v46.35,56.42 46.35,69.63 47.36,70.65 v47.36,73.9 | v28.97,5.32 v26.84,5.32 26.64,5.22 18.91,5.22 16.58,2.88 5.2,2.88 1.85,6.23 1.85,48.9 9.36,56.42 12.01,56.42 19.02,63.43 19.02,64.04 v19.12,64.24 19.12,65.16 27.25,73.29 27.25,74.41 | v27.25,78.47 27.25,74.41 | v45.23,74.41 27.45,74.41 27.25,74.41
AIN  (via drill 0.51)
  Top 0.203: v49.19,23.2 52.75,19.64 52.75,15.99 52.44,15.68 52.44,15.38 U1.26 | v36.08,29.7 36.08,32.95 33.14,35.9 33.14,41.49 29.38,45.25 29.38,47.99 v29.18,48.19 | v24.3,52.16 24.3,60.28 18.71,65.87 18.71,71.56 21.25,74.1 23.18,74.1 25.01,72.27 R60.1
  Bottom 0.203: v49.19,23.2 44.82,23.2 43.3,24.72 41.06,24.72 v36.08,29.7 | v29.18,48.19 28.26,48.19 v24.3,52.16
B1  (via drill 0.51)
  Top 0.203: v63.62,85.48 64.23,84.87 64.23,83.85 R7.2 | v63.52,88.02 63.52,88.63 64.23,89.34 R6.1 | v7.03,87.71 7.03,82.13 4.79,79.89 4.79,70.14 5.91,69.02 5.91,60.69 U2.15
  Bottom 0.203: v63.62,85.48 63.62,87.92 v63.52,88.02 63.52,88.53 52.65,99.4 18.1,99.4 7.03,88.32 v7.03,87.71
B2  (via drill 0.51)
  Top 0.203: v57.42,74.41 60.47,71.36 62.7,71.36 64.63,73.29 R3.2 | v55.79,81.21 55.39,81.21 53.86,79.69 R2.1 53.76,79.69 53.36,80.09 v50,80.09 | v9.67,62.62 8.55,61.5 8.55,60.69 U2.13 | v15.76,68.61 18.3,71.15 18.3,72.58 20.34,74.61 22.16,74.61 v26.03,78.47
  Bottom 0.203: v57.42,74.41 57.42,74.71 55.79,76.34 v55.79,81.21 | v9.67,62.62 14.04,62.62 15.76,64.35 v15.76,68.61 | v26.03,78.47 28.46,80.91 32.93,80.91 35.37,83.35 47.16,83.35 50,80.5 v50,80.09
B3  (via drill 0.51)
  Top 0.203: R13.2 64.02,61.91 63.01,60.89 61.38,60.89 61.18,61.1 61.18,62.92 63.21,64.96 63.21,65.67 65.24,67.7 65.24,70.54 65.04,70.75 63.41,70.75 62.4,69.73 R8.1 62.3,69.63 61.18,68.51 v55.39,68.51 | v6.21,83.04 6.21,81.92 4.08,79.79 4.08,59.57 5.1,58.56 9.46,58.56 10.99,60.08 10.99,60.59 U2.11 | v20.64,86.19 23.49,89.04 32.43,89.04 33.54,90.15 v35.98,90.15
  Bottom 0.203: v6.21,83.04 6.21,83.45 8.96,86.19 v20.64,86.19 | v35.98,90.15 49.09,90.15 52.34,86.9 52.34,71.56 v55.39,68.51
B4  (via drill 0.51)
  Top 0.203: v60.67,58.05 61.89,59.27 R15.1 | v63.01,51.04 63.01,51.75 63.72,52.46 R16.2 | v14.65,61.7 13.63,60.69 U2.9 | v20.84,75.42 33.44,88.02 v33.44,88.83
  Bottom 0.203: v63.01,51.04 60.67,53.37 v60.67,58.05 56.2,62.52 56.2,68.92 54.98,70.14 54.98,76.54 54.58,76.94 54.58,85.58 54.78,85.78 54.78,86.7 53.97,87.51 52.65,87.51 49.19,90.97 35.58,90.97 v33.44,88.83 | v14.65,61.7 14.65,62.21 17.09,64.65 17.09,69.94 20.84,73.69 v20.84,75.42
CS1  (via drill 0.51)
  Top 0.203: v44.31,9.18 44.72,9.18 45.33,9.79 45.63,9.79 U1.14 | v38.32,41.28 37.91,41.28 37.2,40.57 36.59,40.57 U$3.3
  Bottom 0.203: v44.31,9.18 33.04,20.46 20.64,20.46 20.13,20.96 15.66,20.96 12.21,17.51 10.18,17.51 2.96,24.72 2.96,40.17 9.77,46.97 32.63,46.97 v38.32,41.28
CS2
  Top 0.203: U1.13 45.13,10.4 44.82,10.4 44.41,9.99 40.05,9.99 36.19,13.85 35.37,13.85 34.87,14.36 34.87,21.68 37.71,24.52 37.71,31.33 41.16,34.78 42.89,34.78 43.4,35.29 43.4,35.9 43.81,36.3 43.81,38.34 45.94,40.47 46.55,40.47 U$4.3
GND  (via drill 0.51)
  Top 0.5: 45.13,18.22 44.72,18.22 44.01,17.51 44.01,17.1 44.52,16.6 U1.5 | 45.13,18.22 45.63,17.71 U1.3 45.84,17.51 v47.46,15.88 | 45.13,18.22 45.13,18.42 45.13,22.28 45.43,22.59 IC1.7 | C1.2 59.35,23.5 59.35,21.17 C2.2 59.15,21.07 v57.52,21.07 | 51.83,10.3 51.22,10.91 U1.21 | 51.83,10.3 51.83,5.22 51.63,5.01 ISP1.6 | v53.86,15.78 53.86,18.83 R18.1 | v52.54,10.4 52.03,10.4 51.83,10.3 | v54.88,10.8 55.79,9.89 61.59,9.89 U3.4 | R33.2 50.82,97.57 54.17,97.57 55.39,98.79 57.32,98.79 58.33,97.77 58.33,97.57 R23.2 58.54,97.88 59.45,98.79 63.72,98.79 64.63,97.88 64.63,97.57 R28.2 64.84,97.37 v64.84,92.69 | R3.1 62.8,73.39 62.8,74 65.04,76.23 GATE2.GND 65.14,76.44 65.14,76.74 65.85,77.45 65.85,80.3 64.43,81.72 R7.1 64.33,81.92 65.04,82.63 65.14,82.63 65.55,83.04 65.55,85.78 65.14,86.19 GATE1.GND | 63.77,64.5 65.04,65.77 GATE3.GND | 63.77,64.5 62.2,62.92 62.2,62.01 R13.1 | 61.99,51.55 61.99,52.36 R16.1 61.89,52.76 65.04,55.91 GATE4.GND 65.24,56.12 65.24,63.03 63.92,64.35 63.77,64.5 | 61.99,51.55 61.99,50.63 63.41,49.21 63.41,47.89 C14.2 | v44.72,88.83 43.81,87.92 43.81,87.41 R27.1 | C15.2 38.12,48.19 38.62,48.19 39.95,46.87 41.88,46.87 43.2,48.19 C17.2 43.4,48.09 44.62,46.87 | 44.62,46.87 46.95,46.87 47.36,47.28 47.36,47.38 48.17,48.19 C13.2 48.38,48.09 49.6,46.87 52.03,46.87 | 52.03,46.87 52.44,47.28 52.44,47.38 53.25,48.19 C16.2 53.15,48.4 53.15,50.22 | v44.21,42.2 42.59,40.57 41.77,40.57 U$3.12 | v44.21,46.36 44.52,46.67 44.62,46.87 | 53.15,50.22 51.02,52.36 51.02,55.91 OUTPUT4.GND 51.02,56.22 51.02,65.77 OUTPUT3.GND | 52.03,46.87 52.14,46.67 53.36,45.45 53.36,41.28 52.75,40.67 U$4.12 51.83,40.47 52.65,40.47 53.36,39.76 53.36,36.2 52.34,35.19 U$4.8 51.83,35.39 54.37,32.85 56.81,32.85 IC7.7 57.01,32.65 57.42,32.24 v57.42,31.73
  Top 0.5: 61.99,51.55 61.79,51.55 54.58,51.55 53.36,50.33 53.15,50.22 | POWER.8 11.09,6.84 POWER.6 8.55,6.84 POWER.4 8.35,4.5 POWER.3 8.45,4.3 POWER.5 11.09,4.3 13.22,4.3 POWER.7 13.53,4.3 14.95,2.88 16.58,2.88 17.39,3.69 17.39,4.5 | U4.6 15.56,14.97 15.56,13.95 U4.7 15.56,13.75 15.56,12.53 U4.8 15.66,12.33 15.66,9.18 17.39,7.45 17.39,4.5 | C4.- 38.01,3.08 34.15,3.08 32.22,1.15 29.58,1.15 26.23,4.5 17.59,4.5 17.39,4.5 | C5.+ 31.11,7.55 31.11,12.02 29.58,13.55 C7.- 29.38,13.75 29.38,14.16 26.64,16.9 | R40.1 15.87,35.29 15.87,33.26 18.61,30.51 18.61,30.11 23.38,25.33 26.03,25.33 27.45,23.91 POT_R.P$1 27.35,23.71 26.64,23 v26.64,21.47 26.64,16.9 | C22.2 38.01,15.07 38.01,15.68 36.19,17.51 36.19,18.83 R9.1 36.08,19.03 36.08,19.95 v35.68,20.35 | U$3.8 41.67,35.39 40.96,35.39 37.1,31.53 37.1,24.93 34.87,22.69 34.05,22.69 IC4.7 34.05,22.39 v34.05,21.57 | v22.37,15.27 24.91,15.27 26.43,16.8 26.64,16.9 | R38.2 44.31,97.57 44.31,97.88 42.89,99.3 26.53,99.3 25.62,98.38 C12.2 25.52,98.18 24.09,96.76 21.76,96.76 20.95,97.57 19.12,97.57 C3.2 18.91,97.77 18.2,98.48 18.2,98.59 17.9,98.89 16.27,98.89 13.43,96.05 13.43,84.06 POT_SA.P$1 | 9.11,81.16 10.38,82.43 12.01,82.43 13.43,83.85 POT_SA.P$1 | 9.11,81.16 7.94,79.99 7.94,79.89 7.13,79.08 C10.2 | 19.02,81.21 19.02,79.79 C18.2 | 19.02,81.21 16.37,83.85 13.73,83.85 POT_SA.P$1 | POT_A.P$1 27.45,83.85 26.94,83.85 24.4,81.31 19.22,81.31 19.02,81.21 | 31.41,79.79 29.68,79.79 C9.1 | 31.41,79.79 36.08,79.79 R22.1 | v32.63,60.49 33.65,60.49 35.17,62.01 36.08,62.01 R32.1 | 27.45,66.89 26.53,67.8 26.43,67.8 25.62,68.61 C11.2
  Top 0.5: 27.45,66.89 27.45,63.94 POT_D.P$1 | 31.41,79.79 31.41,79.59 31.41,70.14 28.26,66.99 27.65,66.99 27.45,66.89 | 31.61,56.93 29.18,56.93 26.94,54.69 26.94,44.43 27.45,43.92 POT_S.P$1 27.35,43.72 27.35,40.98 27.19,40.83 | 31.61,56.93 33.54,56.93 R37.1 | 27.19,40.83 26.23,39.86 22.57,39.86 C8.2 | C20.2 31.72,40.37 30.9,39.56 30.9,39.45 30.6,39.15 28.87,39.15 27.35,40.67 27.19,40.83 | U2.16 4.79,60.59 4.79,59.88 5.5,59.16 6.42,59.16 7.23,59.98 7.23,60.59 U2.14 | U2.14 7.33,59.77 7.94,59.16 8.96,59.16 9.77,59.98 9.77,60.59 U2.12 9.87,60.89 9.87,61.4 10.58,62.11 11.6,62.11 12.31,61.4 12.31,60.69 U2.10 | 10.18,65.36 12.01,65.36 13.33,64.04 POT_SD.P$1 13.53,63.84 13.94,63.84 16.98,60.79 16.98,59.47 C24.1 17.19,59.27 17.39,59.06 17.39,50.02 15.76,48.4 15.76,45.75 R42.1 15.76,45.45 15.05,45.45 13.53,43.92 POT_SR.P$1 13.33,43.72 11.29,41.69 11.29,28.38 13.43,26.25 13.43,23.91 POT_ST.P$1 | 10.18,65.36 7.94,65.36 7.03,64.45 7.03,63.33 7.13,63.23 7.13,60.89 U2.14 | v31.61,57.13 31.61,56.93 | 9.11,81.16 9.26,81.01 10.18,80.09 10.18,65.57 10.18,65.36
  Bottom 0.5: 53.86,11.72 v53.86,15.78 | v52.54,10.4 53.86,11.72 | v53.86,15.78 54.07,15.88 54.78,15.88 57.52,18.63 v57.52,21.07 57.42,21.27 v57.42,31.73 | v47.46,15.88 53.66,15.88 v53.86,15.78 | v54.88,10.8 54.07,11.62 53.86,11.72 | v64.84,92.69 64.84,86.5 65.04,86.29 GATE1.GND | v44.21,46.36 v44.21,42.2 | OUTPUT3.GND 51.02,65.87 51.02,76.03 OUTPUT2.GND 51.02,76.34 51.02,86.09 OUTPUT1.GND 50.92,86.29 50.92,87.31 49.39,88.83 v44.72,88.83 44.52,88.73 34.76,88.73 29.99,83.96 27.55,83.96 POT_A.P$1 | GATE2.GND 65.04,76.23 65.04,65.87 GATE3.GND | v35.68,20.35 35.27,20.35 v34.05,21.57 33.85,21.68 26.64,21.68 | 26.64,21.68 16.78,21.68 14.65,23.81 13.53,23.81 POT_ST.P$1 | v26.64,21.47 26.64,21.68 | v22.37,15.27 14.04,6.94 13.53,6.94 POWER.8 | 31.61,60.49 30.9,60.49 27.55,63.84 POT_D.P$1 | 31.61,60.49 v32.63,60.49 | POT_S.P$1 27.45,43.82 26.94,43.82 25.52,42.4 21.35,42.4 19.93,43.82 13.53,43.82 POT_SR.P$1 | v31.61,57.13 31.61,60.28 31.61,60.49
MISO
  Top 0.203: U1.16 46.85,8.67 46.85,8.36 47.67,7.55 47.67,3.59 46.55,2.47 ISP1.1
MOSI  (via drill 0.51)
  Top 0.203: U1.15 46.35,9.38 46.65,9.38 47.06,9.79 47.16,9.79 47.97,8.97 47.97,7.86 48.99,6.84 48.99,5.01 ISP1.4 | v34.66,38.03 36.49,38.03 U$3.5 | v45.02,34.58 45.02,37.02 45.94,37.93 46.55,37.93 U$4.5 | v59.05,36.41 v59.05,30.31
  Bottom 0.203: v34.66,38.03 36.8,38.03 40.25,34.58 v45.02,34.58 45.02,31.63 45.43,31.22 47.56,31.22 54.68,38.34 55.49,38.34 57.42,36.41 v59.05,36.41 | v59.05,30.31 58.33,29.6 58.33,12.73 53.25,7.65 52.65,7.65 50,5.01 49.09,5.01 ISP1.4
N$1  (via drill 0.51)
  Top 0.203: v42.89,17.51 42.89,16.19 43.4,15.68 43.4,15.38 U1.7 | v40.86,19.54 40.86,20.35 v41.67,21.17 | v54.58,23.3 57.01,23.3 59.25,25.54 C1.1 59.35,25.54 63.11,29.29 64.33,29.29 Q1.2
  Bottom 0.203: v40.86,19.54 v42.89,17.51 | v41.67,21.17 47.26,21.17 49.49,18.93 50.31,18.93 53.36,21.98 53.36,22.08 v54.58,23.3
N$2  (via drill 0.51)
  Top 0.203: v44.01,18.93 43.09,18.93 42.08,17.92 42.08,15.88 42.79,15.17 42.79,14.87 U1.8 | v54.17,21.68 55.69,21.68 58.23,19.14 59.25,19.14 C2.1 59.35,19.14 59.86,19.64 64.33,19.64 Q1.1
  Bottom 0.203: v44.01,18.93 48.89,18.93 49.29,18.53 51.02,18.53 v54.17,21.68
N$4
  Top 0.203: R2.2 55.69,79.59 55.69,78.47 53.56,76.34 GATE2.TIP
N$6
  Top 0.203: R8.2 64.23,69.63 61.59,66.99 54.68,66.99 53.56,65.87 GATE3.TIP
N$8
  Top 0.203: R15.2 63.82,59.27 61.79,57.23 55.08,57.23 53.86,56.02 GATE4.TIP
N$9
  Top 0.203: D1.A 2.76,13.85 9.06,13.85 15.97,6.94 POWER.10 15.97,4.4 POWER.9
N$10
  Top 0.203: D2.C 24.7,2.68 17.19,2.68 16.78,2.27 7.94,2.27 5.91,4.3 POWER.1 5.81,4.4 POWER.2
N$11
  Top 0.203: IC1.9 51.63,23.91 51.63,22.69 IC1.8 51.73,22.69 51.93,22.69 55.79,18.83 R18.2 55.9,18.83 55.9,14.97 57.12,13.75 C26.2
N$14  (via drill 0.51)
  Top 0.203: v53.76,28.99 55.19,28.99 R19.1 | v53.36,26.14 53.15,26.14 52.24,25.23 51.63,25.23 IC1.10
  Bottom 0.203: v53.76,28.99 53.76,28.79 53.15,28.18 53.15,26.35 v53.36,26.14
N$16
  Top 0.203: C3.1 17.09,97.57 21.86,92.8 34.56,92.8 36.8,90.56 36.8,88.73 R20.2 36.8,88.63 36.8,85.58 42.18,80.2 42.59,80.2 43.4,79.38 43.4,78.77 IC2.10 43.4,79.48 44.11,80.2 45.13,80.2 45.94,79.38 45.94,78.77 IC2.12
N$17
  Top 0.203: R21.1 46.24,72.17 42.18,76.23 42.18,78.67 IC2.9 42.18,78.77 42.18,79.28 41.27,80.2 40.55,80.2 40.15,79.79 38.12,79.79 R22.2 38.01,79.79 36.9,78.67 36.29,78.67 33.65,76.03 C6.1
N$18
  Top 0.203: R6.2 64.23,91.27 61.99,91.27 57.01,86.29 53.56,86.29 GATE1.TIP
N$19
  Top 0.203: R9.2 38.12,18.83 38.12,20.56 40.15,22.59 IC4.8 40.25,22.69 40.25,23.91 | 40.25,23.91 40.76,23.91 42.79,25.94 42.79,29.4 44.41,31.02 44.41,32.75 C25.2 | 40.25,23.91 IC4.9 40.25,23.91
N$20  (via drill 0.51)
  Top 0.203: v57.73,42.6 57.73,44.23 R17.1 | v48.07,32.95 48.07,28.58 v47.26,27.77 | v41.98,26.45 40.76,25.23 40.25,25.23 IC4.10
  Bottom 0.203: v48.07,32.95 v57.73,42.6 | v47.26,27.77 43.3,27.77 v41.98,26.45
N$22
  Top 0.203: C25.1 42.38,32.75 42.38,28.08 40.76,26.45 40.25,26.45 IC4.11
N$23  (via drill 0.51)
  Top 0.203: R24.2 40.55,72.17 40.55,75.22 39.54,76.23 OUTPUT2.TIP | v48.38,74.61 48.28,74.51 48.28,72.17 R21.2
  Bottom 0.203: v48.38,74.61 48.38,74.91 49.19,75.73 49.19,80.7 46.95,82.94 46.14,82.94 39.54,76.34 OUTPUT2.TIP
N$24  (via drill 0.51)
  Top 0.203: IC2.13 47.26,78.77 48.48,78.77 IC2.14 48.48,78.88 48.48,79.79 52.24,83.55 v55.79,83.55
  Bottom 0.203: v55.79,83.55 55.79,94.72 55.29,95.23 D4.A
N$26
  Top 0.203: R23.1 56.4,97.57 54.98,97.57 52.75,95.33 D4.K
N$27
  Top 0.203: 36.54,74.96 35.58,75.93 C6.2 | 36.54,74.96 38.62,72.88 38.62,72.17 R24.1 | IC2.8 40.86,78.67 40.25,78.67 36.59,75.02 36.54,74.96
N$28  (via drill 0.51)
  Top 0.203: v38.22,82.13 37.56,82.79 | 37.56,82.79 36.8,83.55 R25.2 | v42.69,82.13 42.69,82.53 43.4,83.24 43.4,83.85 IC2.5 43.5,83.96 43.5,84.56 44.31,85.38 45.13,85.38 45.94,84.56 45.94,83.96 IC2.3 | v17.49,81.31 17.09,80.91 17.09,79.79 C18.1 | v32.53,81.72 34.87,81.72 35.27,81.31 36.08,81.31 37.51,82.74 37.56,82.79
  Bottom 0.203: v42.69,82.13 v38.22,82.13 | v17.49,81.31 32.12,81.31 v32.53,81.72
N$29
  Top 0.203: 45.74,87.41 45.74,86.09 47.26,84.56 47.26,83.96 IC2.2 | 45.74,87.41 R27.2 45.74,87.41 | 45.74,87.41 46.55,88.22 49.6,88.22 50.51,89.14 50.51,90.76 50.21,91.07 48.68,91.07 48.48,90.86 48.48,90.76 47.67,89.95 R26.1 47.56,89.95 46.45,91.07 41.47,91.07 37.71,94.83 37.71,97.37 36.39,98.69 34.76,98.69 33.65,97.57 C19.1
N$30
  Top 0.203: 41.77,89.64 41.77,88.53 39.54,86.29 OUTPUT1.TIP | 41.77,89.64 41.77,89.95 R29.2 41.77,89.64 | 41.77,89.64 45.13,89.64 45.94,88.83 48.38,88.83 48.58,89.04 48.58,89.14 49.39,89.95 R26.2
N$31  (via drill 0.51)
  Top 0.203: v59.55,14.26 57.93,12.63 56.3,12.63 55.19,13.75 C26.1 | v59.55,26.96 52.14,26.96 51.63,26.45 IC1.11
  Bottom 0.203: v59.55,26.96 v59.55,14.26
N$32  (via drill 0.51)
  Top 0.203: 42.18,83.96 40.96,83.96 IC2.7 | 42.18,83.96 IC2.6 42.18,83.96 | v42.18,86.7 42.18,83.96 | v49.39,87.41 52.03,90.05 52.03,90.15 56.1,94.22 61.18,94.22 62.2,95.23 D3.A
  Bottom 0.203: v42.18,86.7 43.2,87.71 49.09,87.71 v49.39,87.41
N$33
  Top 0.203: R28.1 62.8,97.57 61.99,97.57 59.76,95.33 D3.K
N$34
  Top 0.203: 39.95,89.95 39.95,91.98 35.58,96.35 35.58,97.57 C19.2 | 39.95,89.95 R29.1 39.95,89.95 | 39.95,89.95 38.32,88.32 38.32,84.67 41.67,81.31 46.95,81.31 48.48,82.84 48.48,83.85 IC2.1
N$35
  Top 0.203: IC4.2 34.05,28.99 34.05,30.21 IC4.1 33.95,30.31 33.95,34.38 32.73,35.59 32.73,37.52 32.12,38.13 17.69,38.13 | 17.69,38.13 17.69,39.15 C27.2 | 17.69,38.13 17.69,35.39 R40.2
N$36  (via drill 0.51)
  Top 0.203: v4.99,37.32 4.99,40.98 3.17,42.81 3.17,46.77 R41.1 | v32.33,28.38 32.83,28.38 33.44,27.77 33.95,27.77 IC4.3
  Bottom 0.203: v4.99,37.32 15.15,27.16 31.11,27.16 v32.33,28.38
N$38  (via drill 0.51)
  Top 0.203: v35.47,66.89 35.47,68.31 R30.2 | v41.77,65.77 43.4,64.14 43.4,63.53 IC3.5 43.5,63.43 43.5,62.82 44.31,62.01 45.13,62.01 45.94,62.82 45.94,63.43 IC3.3 | v29.79,43.62 29.79,40.47 C20.1 | v31.51,55.91 v31.51,45.35
  Bottom 0.203: v41.77,65.77 40.55,66.99 38.93,66.99 38.83,66.89 v35.47,66.89 33.65,66.89 32.83,66.07 32.83,61.5 33.44,60.89 33.44,57.74 32.02,56.32 31.92,56.32 v31.51,55.91 | v31.51,45.35 v29.79,43.62
N$39  (via drill 0.51)
  Top 0.203: IC3.2 47.26,63.53 47.26,64.04 46.35,64.96 46.35,68.31 R31.1 46.24,68.41 45.23,69.43 42.38,69.43 v41.98,69.02 | 31.11,62.01 31.11,60.79 32.22,59.67 35.68,59.67 38.01,62.01 R32.2 | 31.11,62.01 C21.1 31.11,62.01 | v37.3,67.7 37.3,67.5 32.93,63.13 32.22,63.13 31.11,62.01
  Bottom 0.203: v41.98,69.02 38.62,69.02 v37.3,67.7
N$40
  Top 0.203: OUTPUT3.TIP 39.54,65.87 40.55,66.89 40.55,68.31 R34.2 40.66,68.41 40.66,68.92 41.57,69.83 46.75,69.83 48.17,68.41 R31.2
N$41  (via drill 0.51)
  Top 0.203: IC3.6 42.18,63.53 40.96,63.53 IC3.7 40.96,63.64 40.96,66.68 v42.08,67.8 | v45.13,70.85 49.8,70.85 56.81,77.86 56.81,83.75 55.49,85.07 53.05,85.07 52.24,85.89 52.24,89.14 v52.85,89.75
  Bottom 0.203: v45.13,70.85 v42.08,67.8 | v52.85,89.75 52.85,90.66 48.28,95.23 D5.A
N$42
  Top 0.203: R33.1 48.78,97.57 47.97,97.57 45.74,95.33 D5.K
N$43
  Top 0.203: 36.74,65.72 33.04,62.01 C21.2 | 36.74,65.72 38.62,67.6 38.62,68.31 R34.1 | IC3.1 48.48,63.43 48.48,62.82 47.26,61.6 40.86,61.6 36.8,65.67 36.74,65.72
N$44  (via drill 0.51)
  Top 0.203: v17.8,41.08 15.87,39.15 C27.1 | v19.52,42.81 19.52,43.42 25.52,49.41 v25.52,52.16 | v37.81,44.74 41.57,44.74 v42.18,44.13 | v46.85,32.75 46.85,28.58 46.04,27.77 45.53,27.77 IC1.3
  Bottom 0.203: v19.52,42.81 v17.8,41.08 | v25.52,52.16 28.67,49 33.54,49 v37.81,44.74 | v42.18,44.13 42.18,39.35 46.85,34.68 v46.85,32.75
N$45  (via drill 0.51)
  Top 0.203: v55.9,50.53 58.33,48.09 R35.2 | v51.43,50.53 46.35,55.61 45.53,55.61 43.5,57.64 43.5,58.25 IC3.10 | v35.68,16.6 36.08,16.19 36.08,15.07 C22.1 | v35.27,58.45 38.62,58.45 40.25,60.08 42.28,60.08 43.4,58.96 43.4,58.35 IC3.10 | IC3.12 45.94,58.35 45.94,58.96 45.23,59.67 44.01,59.67 43.4,59.06 IC3.10
  Bottom 0.203: v51.43,50.53 v55.9,50.53 | v35.68,16.6 22.88,16.6 21.05,18.42 15.36,18.42 12.82,15.88 10.58,15.88 2.45,24.01 2.45,44.13 10.99,52.66 10.99,52.87 12.11,53.98 30.8,53.98 v35.27,58.45
N$46
  Top 0.203: C23.1 33.65,51.85 33.65,52.46 35.47,54.29 35.47,56.93 R37.2 35.58,56.93 37.71,56.93 40.45,59.67 41.37,59.67 42.18,58.86 42.18,58.35 IC3.9 42.18,58.25 42.18,57.64 46.24,53.58 46.24,51.85 R36.1
N$47
  Top 0.203: R36.2 48.17,51.85 47.06,50.73 45.53,50.73 44.41,51.85 40.66,51.85 R39.2 40.55,51.85 39.44,50.73 34.76,50.73 34.56,50.94 34.56,52.76 37.71,55.91 39.44,55.91 OUTPUT4.TIP
N$48
  Top 0.203: IC3.13 47.26,58.25 48.48,58.25 IC3.14 48.58,58.35 48.58,61.6 49.8,62.82 49.8,70.24 60.87,81.31 60.87,86.8 61.59,87.51 62.8,87.51 63.11,87.21 63.92,87.21 65.75,89.04 65.75,98.38 64.73,99.4 48.07,99.4 44.01,95.33 41.37,95.33 D6.A
N$49
  Top 0.203: R38.1 42.48,97.57 41.06,97.57 38.83,95.33 D6.K
N$50
  Top 0.203: C23.2 35.58,51.85 38.62,51.85 R39.1 38.73,51.85 40.86,53.98 40.86,58.25 IC3.8
N$51  (via drill 0.51)
  Top 0.203: IC1.6 45.53,23.91 45.53,25.13 IC1.5 45.63,25.13 v47.26,25.13 | v13.22,42.2 13.63,42.2 14.14,42.71 14.95,42.71 17.69,45.45 R42.2 | v25.42,36.81 28.06,36.81 28.97,37.73 30.6,37.73 31.72,36.61 C28.2 31.61,36.61 31.11,36.1 v31.11,33.97
  Bottom 0.203: v13.22,42.2 13.22,41.18 14.95,39.45 14.95,37.22 15.36,36.81 v25.42,36.81 | v47.26,25.13 41.47,25.13 39.34,27.26 39.34,31.33 36.69,33.97 v31.11,33.97
N$52  (via drill 0.51)
  Top 0.203: v7.64,25.43 7.53,25.33 4.28,25.33 3.17,26.45 R43.1 | v43.3,23.5 43.3,24.82 44.92,26.45 45.43,26.45 IC1.4
  Bottom 0.203: v7.64,25.43 13.83,25.43 16.68,22.59 41.27,22.59 42.18,23.5 v43.3,23.5
N$54
  Top 0.203: C28.1 29.79,36.61 29.79,33.16 31.51,31.43 31.51,27.97 33.04,26.45 33.95,26.45 IC4.4
N$69  (via drill 0.51)
  Top 0.203: v23.59,71.05 25.82,71.05 26.94,72.17 R60.2 | v11.6,57.44 9.77,57.44 9.16,56.83 9.16,47.58 6.21,44.64 v6.21,41.59 | v13.12,31.63 13.12,30.51 19.12,24.52 19.12,20.96 19.32,20.76 21.55,20.76 21.86,20.46 21.86,18.53 21.55,18.22 18,18.22 17.39,18.83 15.56,18.83 U4.3
  Bottom 0.203: v23.59,71.05 23.59,70.44 15.46,62.31 15.46,61.3 v11.6,57.44 | v6.21,41.59 5.4,40.78 5.4,39.35 v13.12,31.63
POT_A  (via drill 0.51)
  Top 0.203: v12.21,88.93 6.42,88.93 1.74,84.26 1.74,25.94 8.96,18.73 10.18,18.73 13.22,15.68 16.68,15.68 18.51,17.51 20.44,17.51 U4.13 | v21.86,86.19 22.67,86.19 24.91,83.96 POT_A.P$2
  Bottom 0.203: v12.21,88.93 19.12,88.93 v21.86,86.19
POT_D  (via drill 0.51)
  Top 0.203: v22.67,60.59 22.67,48.6 16.37,42.3 14.54,42.3 13.63,41.39 13.22,41.39 11.9,40.06 11.9,30.51 15.87,26.55 15.87,23 19.93,18.93 20.44,18.93 U4.14
  Bottom 0.203: v22.67,60.59 22.67,61.2 24.91,63.43 24.91,63.84 POT_D.P$2
POT_R
  Top 0.203: U4.12 20.54,16.39 21.05,16.39 24.91,20.25 24.91,23.81 POT_R.P$2
POT_S
  Top 0.203: U4.15 20.44,20.15 19.32,20.15 16.27,23.2 16.27,26.75 12.31,30.72 12.31,37.63 16.68,42 23.08,42 24.91,43.82 POT_S.P$2
POT_SA  (via drill 0.51)
  Top 0.203: v14.24,26.86 15.46,25.64 15.46,21.47 U4.1 | v4.18,39.56 4.18,41.18 2.15,43.21 2.15,84.06 6.62,88.53 7.43,88.53 10.99,84.97 10.99,83.96 POT_SA.P$2
  Bottom 0.203: v14.24,26.86 4.18,36.92 v4.18,39.56
POT_SD  (via drill 0.51)
  Top 0.203: v11.8,18.32 13.73,16.39 15.46,16.39 U4.5 | v8.04,27.67 8.04,29.7 8.45,30.11 8.45,33.56 7.84,34.17 7.84,42.71 7.23,43.32 7.23,44.43 13.02,50.22 13.02,61.91 11.09,63.84 POT_SD.P$2
  Bottom 0.203: v11.8,18.32 11.8,18.73 6.42,24.11 6.42,26.04 v8.04,27.67
POT_SR  (via drill 0.51)
  Top 0.203: v4.38,24.52 9.77,19.14 12.21,19.14 13.73,17.61 15.46,17.61 U4.4
  Bottom 0.203: v4.38,24.52 4.38,36.1 3.37,37.12 3.37,39.96 6.01,42.6 9.77,42.6 10.99,43.82 POT_SR.P$2
POT_ST
  Top 0.203: U4.2 15.46,20.15 14.75,20.15 11.09,23.81 POT_ST.P$2
PULSE1
  Top 0.203: R17.2 59.55,44.23 59.55,43.11 56.91,40.47 IC7.1
PULSE2
  Top 0.203: R19.2 57.12,28.99 57.12,29.6 58.64,31.12 58.64,35.59 58.23,36 58.23,38.34 57.42,39.15 56.91,39.15 IC7.2
PULSE3  (via drill 0.51)
  Top 0.203: v6.21,40.37 4.99,41.59 4.99,46.77 R41.2 | v34.76,36.1 37.81,36.1 39.13,37.42 39.13,37.73 40.05,38.64 42.99,38.64 43.4,39.05 43.4,39.86 v43.5,39.96 | v54.17,40.37 54.17,37.22 54.78,36.61 56.81,36.61 IC7.4
  Bottom 0.203: v6.21,40.37 6.82,40.37 14.44,32.75 24.81,32.75 26.03,31.53 26.84,31.53 31.41,36.1 v34.76,36.1 | v43.5,39.96 47.36,39.96 49.6,37.73 51.53,37.73 v54.17,40.37
PULSE4  (via drill 0.51)
  Top 0.203: v6.42,27.26 5.6,26.45 5.1,26.45 R43.2 | v5.6,24.52 6.01,24.52 10.99,19.54 13.12,19.54 14.44,18.22 16.78,18.22 v17.39,17.61 | v60.37,16.09 56.81,19.64 56.81,19.74 56.2,20.35 v55.79,20.35 | v56.4,30.51 57.42,30.51 58.23,31.33 58.23,34.58 57.52,35.29 56.91,35.29 IC7.5
  Bottom 0.203: v6.42,27.26 6.42,26.65 5.6,25.84 v5.6,24.52 | v17.39,17.61 21.25,17.61 29.07,9.79 42.08,9.79 44.41,7.45 44.41,2.88 46.04,1.25 53.05,1.25 60.37,8.57 v60.37,16.09 | v55.79,20.35 55.79,29.9 v56.4,30.51
RST  (via drill 0.51)
  Top 0.203: v49.8,11.52 49.8,15.99 50.61,16.8 50.61,17 U1.29 | v52.85,8.47 52.85,3.69 51.63,2.47 ISP1.5
  Bottom 0.203: v52.85,8.47 v49.8,11.52
S0
  Top 0.203: U1.23 52.44,12.12 52.44,11.82 53.66,10.6 53.66,2.88 52.03,1.25 42.69,1.25 38.32,5.62 30.29,5.62 21.86,14.05 21.86,14.16 21.05,14.97 20.54,14.97 U4.11
S1  (via drill 0.51)
  Top 0.203: v33.34,0.85 33.75,0.44 51.83,0.44 54.07,2.68 54.07,11.31 52.95,12.43 52.95,12.63 U1.24 | v28.77,4.1 27.96,4.91 27.96,7.35 21.55,13.75 20.54,13.75 U4.10
  Bottom 0.203: v33.34,0.85 32.02,0.85 v28.77,4.1
S2  (via drill 0.51)
  Top 0.203: v50.61,13.55 51.43,13.55 52.65,14.77 52.85,14.77 U1.25 | v40.76,6.33 v45.63,6.33 | v22.77,7.96 22.77,10.19 20.54,12.43 U4.9
  Bottom 0.203: v50.61,13.55 48.99,11.92 48.99,10.7 51.12,8.57 51.12,7.76 49.7,6.33 v45.63,6.33 | v40.76,6.33 40.55,6.33 38.93,7.96 v22.77,7.96
SCK  (via drill 0.51)
  Top 0.203: ISP1.3 49.09,2.47 50.21,3.59 50.21,6.23 48.99,7.45 48.99,8.67 U1.17 48.89,8.77 48.89,9.08 v47.16,10.8 | v38.42,38.24 37.41,39.25 36.59,39.25 U$3.4 | v44.21,35.49 44.21,37.52 45.94,39.25 46.55,39.25 U$4.4 46.65,39.25 47.26,39.25 49.8,36.71 v49.8,29.9
  Bottom 0.203: v38.42,38.24 38.42,37.02 39.95,35.49 v44.21,35.49 | v47.16,10.8 47.16,11.62 45.94,12.84 45.94,14.16 46.35,14.56 46.35,15.38 41.37,20.35 41.27,20.35 40.86,20.76 40.86,21.57 41.67,22.39 49.6,22.39 50,22.79 50,29.7 v49.8,29.9
TRIG  (via drill 0.51)
  Top 0.203: v49.9,19.74 48.99,18.83 U1.32 | v55.08,37.52 56.51,37.52 56.81,37.83 IC7.3
  Bottom 0.203: v49.9,19.74 49.9,22.08 52.54,24.72 52.54,32.04 54.27,33.77 54.27,36.71 v55.08,37.52
TRIG1  (via drill 0.51)
  Top 0.203: v50.61,14.77 51.73,15.88 U1.27 | v44.72,13.24 v46.75,13.24 | v38.12,21.78 38.12,26.25 39.54,27.67 40.15,27.67 IC4.12 40.25,27.77 40.25,28.99 IC4.13 | v54.58,91.47 54.27,91.17 54.27,90.05 R5.1 | v4.38,57.44 4.38,56.12 4.69,55.81 U2.1
  Bottom 0.203: v50.61,14.77 48.28,14.77 v46.75,13.24 | v38.12,21.78 38.12,21.07 44.72,14.46 v44.72,13.24 44.72,9.99 45.13,9.58 45.13,7.04 44.82,6.74 44.82,5.01 46.04,3.79 53.15,3.79 58.74,9.38 58.74,28.79 60.87,30.92 61.08,30.92 63.82,33.66 63.82,52.26 63.21,52.87 63.21,58.45 56.61,65.06 56.61,74.91 55.39,76.13 55.39,80.4 54.98,80.81 54.98,85.38 55.19,85.58 55.19,90.86 v54.58,91.47 53.56,91.47 46.04,98.99 20.34,98.99 4.38,83.04 v4.38,57.44
TRIG2  (via drill 0.51)
  Top 0.203: 49.44,20.51 49.49,20.56 50.31,20.56 51.63,19.24 51.63,17 51.22,16.6 U1.28 | 49.44,20.51 47.77,18.83 46.85,18.83 U1.1 | v60.87,72.17 60.87,76.74 62.5,78.37 62.7,78.37 R1.1 | v59.55,28.38 58.33,28.38 57.73,27.77 v53.97,27.77 51.63,27.77 IC1.12 | v7.23,57.74 7.23,55.81 U2.3 | v53.05,88.32 55.39,88.32 v56.61,87.1 | IC1.13 51.63,28.99 51.63,27.87 IC1.12 | v55.08,33.87 55.29,34.07 56.81,34.07 IC7.6 | 49.44,20.51 49.39,20.56 49.39,21.78 48.38,22.79 48.38,25.03 51.02,27.67 51.53,27.67 IC1.12
  Bottom 0.203: v59.55,28.38 64.23,33.05 64.23,52.46 63.82,52.87 63.82,58.45 60.87,61.4 v60.87,72.17 60.87,76.64 56.61,80.91 v56.61,87.1 | v7.23,57.74 7.23,67.7 4.79,70.14 4.79,82.84 20.54,98.59 40.96,98.59 48.17,91.37 50,91.37 v53.05,88.32 | v55.08,33.87 55.08,31.63 54.58,31.12 54.58,28.38 v53.97,27.77
TRIG3  (via drill 0.51)
  Top 0.203: U1.19 50,9.89 50,10.09 47.56,12.53 47.56,13.65 47.16,14.05 43.5,14.05 43.3,13.85 42.99,13.85 41.67,15.17 41.67,19.95 42.48,20.76 42.48,25.03 44.11,26.65 44.11,28.18 44.92,28.99 45.43,28.99 IC1.2 45.53,28.99 45.53,30.21 IC1.1 45.53,30.31 45.84,30.62 v45.84,32.04 | v52.65,67.8 52.65,70.04 R4.1 | v11.8,52.46 9.87,54.39 9.87,55.71 U2.5 | v36.29,49.92 38.32,49.92 v39.74,48.5
  Bottom 0.203: v52.65,67.8 52.65,66.58 52.24,66.18 52.24,58.96 49.19,55.91 49.19,53.98 41.72,46.52 | 41.72,46.52 40.55,45.35 40.55,39.15 39.13,37.73 39.13,36.92 39.74,36.3 44.62,36.3 45.84,35.09 v45.84,32.04 | v11.8,52.46 14.34,52.46 14.85,52.97 33.24,52.97 v36.29,49.92 | v39.74,48.5 41.67,46.57 41.72,46.52
TRIG4  (via drill 0.51)
  Top 0.203: v54.88,17.41 54.88,15.58 53.15,13.85 52.65,13.85 51.32,12.53 51.32,12.23 51.73,11.82 51.73,11.62 U1.22 | v52.95,57.54 52.95,59.06 R14.1 | v7.03,36.51 7.03,42 6.82,42.2 6.82,44.64 12.61,50.43 12.61,52.87 12.41,53.07 12.41,55.71 U2.7 | v30.7,27.97 33.44,25.23 33.95,25.23 IC4.5 34.05,25.13 34.05,23.91 IC4.6 | v55.9,31.73 53.66,31.73 v52.34,33.05
  Bottom 0.203: v54.88,17.41 54.88,21.17 55.39,21.68 55.39,31.33 55.84,31.78 | 55.84,31.78 61.89,37.83 61.89,49.92 54.98,56.83 54.98,57.95 54.58,58.35 53.76,58.35 v52.95,57.54 | v7.03,36.51 15.56,27.97 v30.7,27.97 31.21,28.48 31.21,31.73 30.29,32.65 30.29,34.38 30.7,34.78 39.23,34.78 43.3,30.72 50.61,30.72 52.34,32.44 v52.34,33.05 | v55.9,31.73 55.84,31.78
VOUTA  (via drill 0.51)
  Top 0.203: v35.68,82.13 34.97,82.84 34.97,83.55 R25.1 | v33.24,77.55 32.02,76.34 32.02,66.18 v25.11,59.27 | v23.49,57.64 23.49,51.75 v24.7,50.53 | v38.93,43.92 40.86,43.92 41.67,43.11 U$3.14
  Bottom 0.203: v35.68,82.13 35.68,79.99 v33.24,77.55 | v23.49,57.64 v25.11,59.27 | v24.7,50.53 25.31,50.53 28.46,47.38 33.95,47.38 37.41,43.92 v38.93,43.92
VOUTB  (via drill 0.51)
  Top 0.203: v29.68,73.19 29.68,77.45 28.46,78.67 28.46,80.91 34.87,87.31 34.87,88.63 R20.1 | v28.46,61.4 v31.21,64.14 | v28.46,54.8 28.46,52.56 27.55,51.65 27.55,47.58 28.77,46.36 28.77,41.59 v28.36,41.18 | v33.95,37.02 33.95,35.7 34.87,34.78 39.13,34.78 40.45,36.1 42.99,36.1 43.2,36.3 43.2,37.12 42.38,37.93 41.77,37.93 U$3.10
  Bottom 0.203: v29.68,73.19 31.21,71.66 v31.21,64.14 | v28.46,54.8 v28.46,61.4 | v28.36,41.18 29.79,41.18 v33.95,37.02
VOUTC  (via drill 0.51)
  Top 0.203: v33.65,65.06 33.65,68.31 R30.1 | v37.71,46.67 39.34,46.67 40.86,45.14 49.7,45.14 51.73,43.11 U$4.14
  Bottom 0.203: v33.65,65.06 33.65,61.3 37.71,57.23 v37.71,46.67
VOUTD  (via drill 0.51)
  Top 0.203: v54.37,42.91 56.4,44.94 56.4,47.99 R35.1 | v50,38.54 51.22,38.54 51.73,38.03 U$4.10
  Bottom 0.203: v50,38.54 v54.37,42.91

### Text on the board
tPlace: Pure QUAD ADSR V1.0 | T1 | POWER
bPlace: copyright GMSN Ltd / Andy C 2018 | Attack Shape | ATTACK | Decay Shape | DECAY | Sustain Time | SUSTAIN | RELEASE Shape | RELEASE | Pure Quad ADSR / PCB1